# Altium project BeagleBone-AI.PrjPcb (part 2 of 5)

## Sheet 08 DDR VTT_LEDs.SchDoc
size 420 x 297 mm
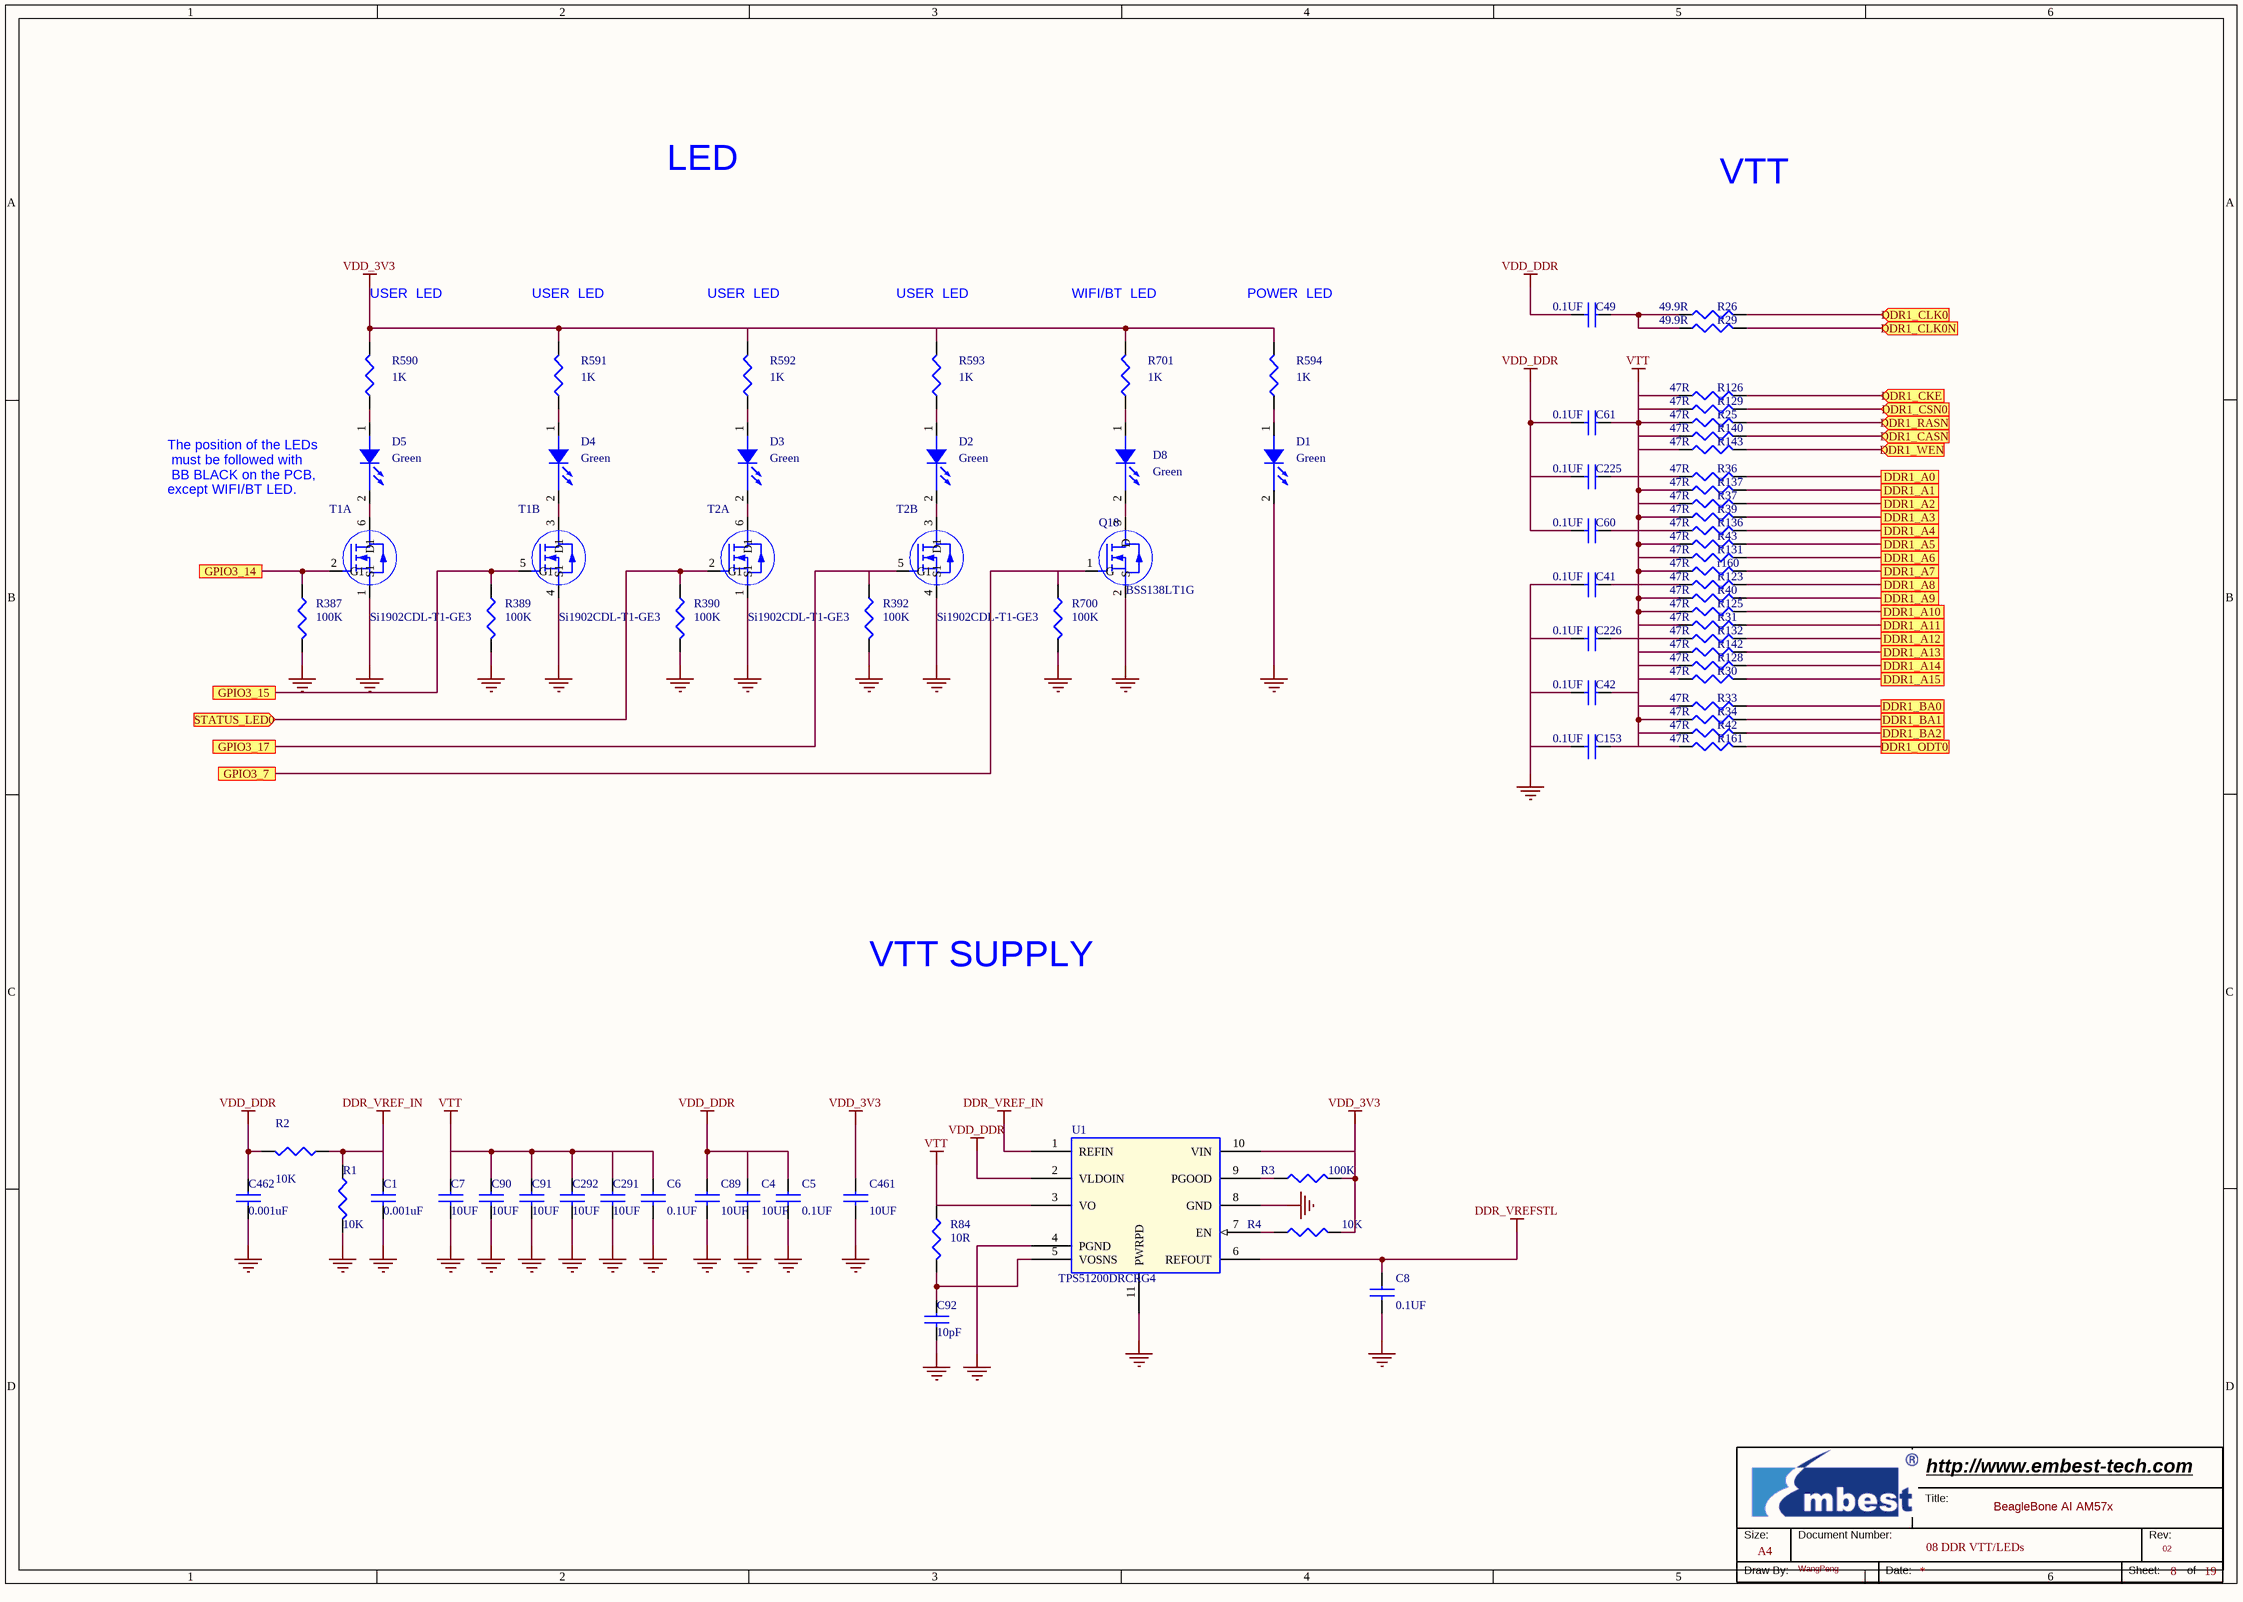
[diagram p6: 08 DDR VTT_LEDs.SchDoc]

### Parts
(Parts that share a designator on the sheet are numbered #1, #2 ... from top to bottom, then left to right.)
*#6  Page Count: 19  Page Number: 8  Page Size: A4  Title: BeagleBone AI AM57x  RevCode: 02  Doc: 08 DDR VTT/LEDs  Drawing: WangPeng  (hidden comment: Embest Title)  (graphical)
C1  0.001uF  [C0402]
C4  10UF  [C0603]
C5  0.1UF  [C0402]
C6  0.1UF  [C0402]
C7  10UF  [C0603]
C8  0.1UF  [C0402]
C41  0.1UF  [C0402]
C42  0.1UF  [C0402]
C49  0.1UF  [C0402]
C60  0.1UF  [C0402]
C61  0.1UF  [C0402]
C89  10UF  [C0603]
C90  10UF  [C0603]
C91  10UF  [C0603]
C92  10pF  [C0402]
C153  0.1UF  [C0402]
C225  0.1UF  [C0402]
C226  0.1UF  [C0402]
C291  10UF  [C0603]
C292  10UF  [C0603]
C461  10UF  [C0603]
C462  0.001uF  [C0402]
D1  Green  [D0603]
D2  Green  [D0603]
D3  Green  [D0603]
D4  Green  [D0603]
D5  Green  [D0603]
D8  Green  [D0603]
Q18  BSS138LT1G  [SOT95P240X111-3N]
R1  10K  [R0402]
R2  10K  [R0402]
R3  100K  [R0402]
R4  10K  [R0402]
R25  47R  [R0402]
R26  49.9R  [R0402]
R29  49.9R  [R0402]
R30  47R  [R0402]
R31  47R  [R0402]
R33  47R  [R0402]
R34  47R  [R0402]
R36  47R  [R0402]
R37  47R  [R0402]
R39  47R  [R0402]
R40  47R  [R0402]
R42  47R  [R0402]
R43  47R  [R0402]
R84  10R  [R0402]
R123  47R  [R0402]
R125  47R  [R0402]
R126  47R  [R0402]
R128  47R  [R0402]
R129  47R  [R0402]
R131  47R  [R0402]
R132  47R  [R0402]
R136  47R  [R0402]
R137  47R  [R0402]
R140  47R  [R0402]
R142  47R  [R0402]
R143  47R  [R0402]
r160  47R  [R0402]
R161  47R  [R0402]
R387  100K  [R0402]
R389  100K  [R0402]
R390  100K  [R0402]
R392  100K  [R0402]
R590  1K  [R0402]
R591  1K  [R0402]
R592  1K  [R0402]
R593  1K  [R0402]
R594  1K  [R0402]
R700  100K  [R0402]
R701  1K  [R0402]
T1  Si1902CDL-T1-GE3  [sot363_6]  (parts A,B of 2)
T2  Si1902CDL-T1-GE3  [sot363_6]  (parts A,B of 2)
U1  TPS51200DRCRG4  [VSON50P300X300X100-11N]

### Ports
DDR1_A0, DDR1_A1, DDR1_A2, DDR1_A3, DDR1_A4, DDR1_A5, DDR1_A6, DDR1_A7, DDR1_A8, DDR1_A9, DDR1_A10, DDR1_A11, DDR1_A12, DDR1_A13, DDR1_A14, DDR1_A15, DDR1_BA0, DDR1_BA1, DDR1_BA2, DDR1_CASN (in), DDR1_CKE (in), DDR1_CLK0 (in), DDR1_CLK0N (in), DDR1_CSN0 (in), DDR1_ODT0, DDR1_RASN (in), DDR1_WEN (in), GPIO3_7, GPIO3_14, GPIO3_15, GPIO3_17, STATUS_LED0 (in)

### Nets
DDR_VREF_IN: C1.1 R1.1 R2.1 U1.1(REFIN)
DDR_VREFSTL: C8.1 U1.6(REFOUT)
GND: C1.2 C4.2 C5.2 C6.2 C7.2 C8.2 C41.2 C42.2 C89.2 C90.2 C91.2 C92.2 C153.2 C226.2 C291.2 C292.2 C461.2 C462.2 D1.2(C) Q18.2(S) R1.2 R387.2 R389.2 R390.2 R392.2 R700.2 T1.1(S1) T1.4(S1) T2.1(S1) T2.4(S1) U1.4(PGND) U1.8(GND) U1.11(PWRPD)  [project net DDR1_RST]
VDD_3V3: C461.1 R3.2 R4.2 R590.2 R591.2 R592.2 R593.2 R594.2 R701.2 U1.10(VIN)
VDD_DDR: C4.1 C5.1 C49.2 C60.2 C61.2 C89.1 C225.2 C462.1 R2.2 U1.2(VLDOIN)
VTT: C6.1 C7.1 C42.1 C61.1 C90.1 C91.1 C153.1 C226.1 C291.1 C292.1 R25.2 R30.2 R31.2 R33.2 R34.2 R37.2 R39.2 R40.2 R42.2 R43.2 R84.1 R125.2 R126.2 R128.2 R129.2 R131.2 R132.2 R137.2 R140.2 R142.2 R143.2 r160.2 R161.2 U1.3(VO)
DDR1_A0: R36.1 ; port DDR1_A0
DDR1_A1: R137.1 ; port DDR1_A1
DDR1_A2: R37.1 ; port DDR1_A2
DDR1_A3: R39.1 ; port DDR1_A3
DDR1_A4: R136.1 ; port DDR1_A4
DDR1_A5: R43.1 ; port DDR1_A5
DDR1_A6: R131.1 ; port DDR1_A6
DDR1_A7: r160.1 ; port DDR1_A7
DDR1_A8: R123.1 ; port DDR1_A8
DDR1_A9: R40.1 ; port DDR1_A9
DDR1_A10: R125.1 ; port DDR1_A10
DDR1_A11: R31.1 ; port DDR1_A11
DDR1_A12: R132.1 ; port DDR1_A12
DDR1_A13: R142.1 ; port DDR1_A13
DDR1_A14: R128.1 ; port DDR1_A14
DDR1_A15: R30.1 ; port DDR1_A15
DDR1_BA0: R33.1 ; port DDR1_BA0
DDR1_BA1: R34.1 ; port DDR1_BA1
DDR1_BA2: R42.1 ; port DDR1_BA2
DDR1_CASN: R140.1 ; port DDR1_CASN
DDR1_CKE: R126.1 ; port DDR1_CKE
DDR1_CLK0: R26.1 ; port DDR1_CLK0
DDR1_CLK0N: R29.1 ; port DDR1_CLK0N
DDR1_CSN0: R129.1 ; port DDR1_CSN0
DDR1_ODT0: R161.1 ; port DDR1_ODT0
DDR1_RASN: R25.1 ; port DDR1_RASN
DDR1_WEN: R143.1 ; port DDR1_WEN
NetC41_1: C41.1 R123.2
NetC49_1: C49.1 R26.2 R29.2
NetC60_1: C60.1 R136.2
NetC92_1: C92.1 R84.2 U1.5(VOSNS)
NetC225_1: C225.1 R36.2
NetD1_1: D1.1(A) R594.1
NetD2_1: D2.1(A) R593.1
NetD2_2: D2.2(C) T2.3(D1)
NetD3_1: D3.1(A) R592.1
NetD3_2: D3.2(C) T2.6(D1)
NetD4_1: D4.1(A) R591.1
NetD4_2: D4.2(C) T1.3(D1)
NetD5_1: D5.1(A) R590.1
NetD5_2: D5.2(C) T1.6(D1)
NetD8_1: D8.1(A) R701.1
NetD8_2: D8.2(C) Q18.3(D)
NetQ18_1: Q18.1(G) R700.1 ; port GPIO3_7
NetR3_1: R3.1 U1.9(PGOOD)
NetR4_1: R4.1 U1.7(EN)
NetR387_1: R387.1 T1.2(G1) ; port GPIO3_14
NetR389_1: R389.1 T1.5(G1) ; port GPIO3_15
NetR390_1: R390.1 T2.2(G1) ; port STATUS_LED0
NetR392_1: R392.1 T2.5(G1) ; port GPIO3_17

### Notes on the sheet
- LED
- VTT
- (near R590) USER  LED
- (near R591) USER  LED
- (near R592) USER  LED
- (near R593) USER  LED
- (near R701) WIFI/BT  LED
- (near R594) POWER  LED
- The position of the LEDs
  must be followed with
  BB BLACK on the PCB,
  except WIFI/BT LED.
- VTT SUPPLY
- (in symbol Embest Title) Title:; Size:; Document Number:; Rev:; Draw By:; Date:; Sheet:; of

### Library data of the parts
C1 = C: CAP,1NF,+/-10%,X7R,50V,SMD0402; Manufacturer Part Number: GRM155R71H102KA01D; Manufacturer: Murata; Embest PN: 1004001100030; Part Type: Ceramic Capacitor
C4 C7 C89-C91 C291 C461 = C: as C113 on sheet 03 PMIC1; Part Type: Ceramic Capacitor; Datasheet: Y:\ÐÂK3ÏµÍ³ÎïÁÏdatasheet\[1003_1004]capacitor-resistor µçÈÝ¡¢µç×è\1004001100129T2 C1608X5R1A106M.pdf
C5 C41 C60 C61 C225 C226 = C: as C147 on sheet 03 PMIC1; Part Type: Ceramic Capacitor; Datasheet: Y:\ÐÂK3ÏµÍ³ÎïÁÏdatasheet\[1003_1004]capacitor-resistor µçÈÝ¡¢µç×è\1004001100047-GRM155R71C104KA88D.pdf
C6 C8 C42 C49 C153 = C: as C320 on sheet 03 PMIC1; Datasheet: Y:\ÐÂK3ÏµÍ³ÎïÁÏdatasheet\[1003_1004]capacitor-resistor µçÈÝ¡¢µç×è\1004001100047-GRM155R71C104KA88D.pdf; Part Type: Ceramic Capacitor
C92 = C: CAP,10PF,+/-5%,C0G,50V,SMD0402; Manufacturer: MURATA; Manufacturer Part Number: GRM1555C1H100JA01D; Embest PN: 1004001100005; Part Type: Ceramic Capacitor
C292 = C: as C130 on sheet 03 PMIC1; Datasheet: Y:\ÐÂK3ÏµÍ³ÎïÁÏdatasheet\[1003_1004]capacitor-resistor µçÈÝ¡¢µç×è\1004001100129T2 C1608X5R1A106M.pdf; Part Type: Ceramic Capacitor
C462 = C: CAP,1NF,+/-10%,X7R,50V,SMD0402; Manufacturer: Murata; Manufacturer Part Number: GRM155R71H102KA01D; Embest PN: 1004001100030; Part Type: Ceramic Capacitor
D1-D5 = LED: LED,Super Yellow Green,Water Clear,20mA,SMD0603; Manufacturer: Everlight; Manufacturer Part Number: 19-217/G7C-AN1P2/3T; Embest PN: 1006001100015; Part Type: LED; Status: AVL
D8 = LED: LED,Super Yellow Green,Water Clear,20mA,SMD0603; Manufacturer Part Number: 19-217/G7C-AN1P2/3T; Manufacturer: Everlight; Embest PN: 1006001100015; Status: AVL; Part Type: LED
Q18 = NMOS: Mosfet,N-Channel,BSS138LT1G,50V,0.2A,SOT-23,SMD; Manufacturer: ON; Embest PN: 1006015100009; Part Type: MOSFET; Manufacturer Part Number: BSS138LT1G; Status: AM5728; Datasheet: Y:\ÐÂK3ÏµÍ³ÎïÁÏdatasheet\[1006014~16]mosfet ³¡Ð§Ó¦¹Ü\1006015100009_bss138lt1g_ON.pdf
R1 = R: RES,10K,+/-1%,1/16W,SMD0402; Manufacturer Part Number: RC0402FR-0710KL; Manufacturer: YAGEO; Embest PN: 1003001100071; Part Type: Thick film Resistor
R2 = R: RES,10K,+/-1%,1/16W,SMD0402; Manufacturer: YAGEO; Manufacturer Part Number: RC0402FR-0710KL; Embest PN: 1003001100071; Part Type: Thick film Resistor
R3 R387 R389 R390 R392 R700 = R: RES,100K,+/-5%,1/16W,SMD0402; Manufacturer: YAGEO; Manufacturer Part Number: RC0402JR-07100KL; Embest PN: 1003001100119; Part Type: Thick film Resistor
R4 = R: as R121 on sheet 03 PMIC1; Part Type: Thick film Resistor
R25 R30 R33 R34 R36 R37 R40 R42 R43 R125 R126 R128 R132 R136 R143 r160 R161 = R: RES,47R,+/-1%,1/16W,SMD0402; Manufacturer: YAGEO; Manufacturer Part Number: RC0402FR-0747RL; Embest PN: 1003001100518; Part Type: Thick film Resistor
R26 = R: RES,49R9,+/-1%,1/16W,SMD0402; Manufacturer Part Number: RC0402FR-0749R9L; Manufacturer: YAGEO; Embest PN: 1003001100015; Part Type: Thick film Resistor
R29 = R: RES,49R9,+/-1%,1/16W,SMD0402; Manufacturer: YAGEO; Manufacturer Part Number: RC0402FR-0749R9L; Embest PN: 1003001100015; Part Type: Thick film Resistor
R31 R39 R123 R129 R131 R137 R140 R142 = R: RES,47R,+/-1%,1/16W,SMD0402; Manufacturer Part Number: RC0402FR-0747RL; Manufacturer: YAGEO; Embest PN: 1003001100518; Part Type: Thick film Resistor
R84 = R: RES,10R,+/-1%,1/16W,SMD0402; Manufacturer Part Number: RC0402FR-0710RL; Manufacturer: YAGEO; Embest PN: 1003001100004; Part Type: Thick film Resistor
R590 R592 R594 = R: RES,1K,+/-5%,1/16W,SMD0402; Manufacturer: YAGEO; Manufacturer Part Number: RC0402JR-071KL; Embest PN: 1003001100035; Part Type: Thick film Resistor
R591 R593 R701 = R: RES,1K,+/-5%,1/16W,SMD0402; Manufacturer Part Number: RC0402JR-071KL; Manufacturer: YAGEO; Embest PN: 1003001100035; Part Type: Thick film Resistor
T1 T2 = NMOS_2S2G2D: Mosfet,N-Channel,Si1902CDL-T1-GE3,20V,385mohm,1.5A,SOT-363,SMD; Manufacturer: VISHAY; Embest PN: 1006015100011; Part Type: MOSFET; Manufacturer Part Number: Si1902CDL-T1-GE3; Status: TBD; Datasheet: Y:\ÐÂK3ÏµÍ³ÎïÁÏdatasheet\[1006014~16]mosfet ³¡Ð§Ó¦¹Ü\1006015100011_si1902cdl_Vishay.pdf
U1 = TPS51200: IC Sink and Source DDR Termination Regulator VSON-10 SMD; Manufacturer: TI; Embest PN: 1002020100280; Part Type: Specific IC; Manufacturer Part Number: TPS51200DRCRG4; Status: AM5728; Datasheet: Y:\ÐÂK3ÏµÍ³ÎïÁÏdatasheet\[1002]IC ¼¯³ÉµçÂ·\1002020100280 [TPS51200DRCRG4]TPS51200.pdf
*#6 = Embest Title: Page Create Date: May 29, 2006; WebSite: http://www.embest-tech.com; Company: Embest; Page Modify Date: *

## Sheet 09 MMC_UBOOT.SchDoc
size 420 x 297 mm
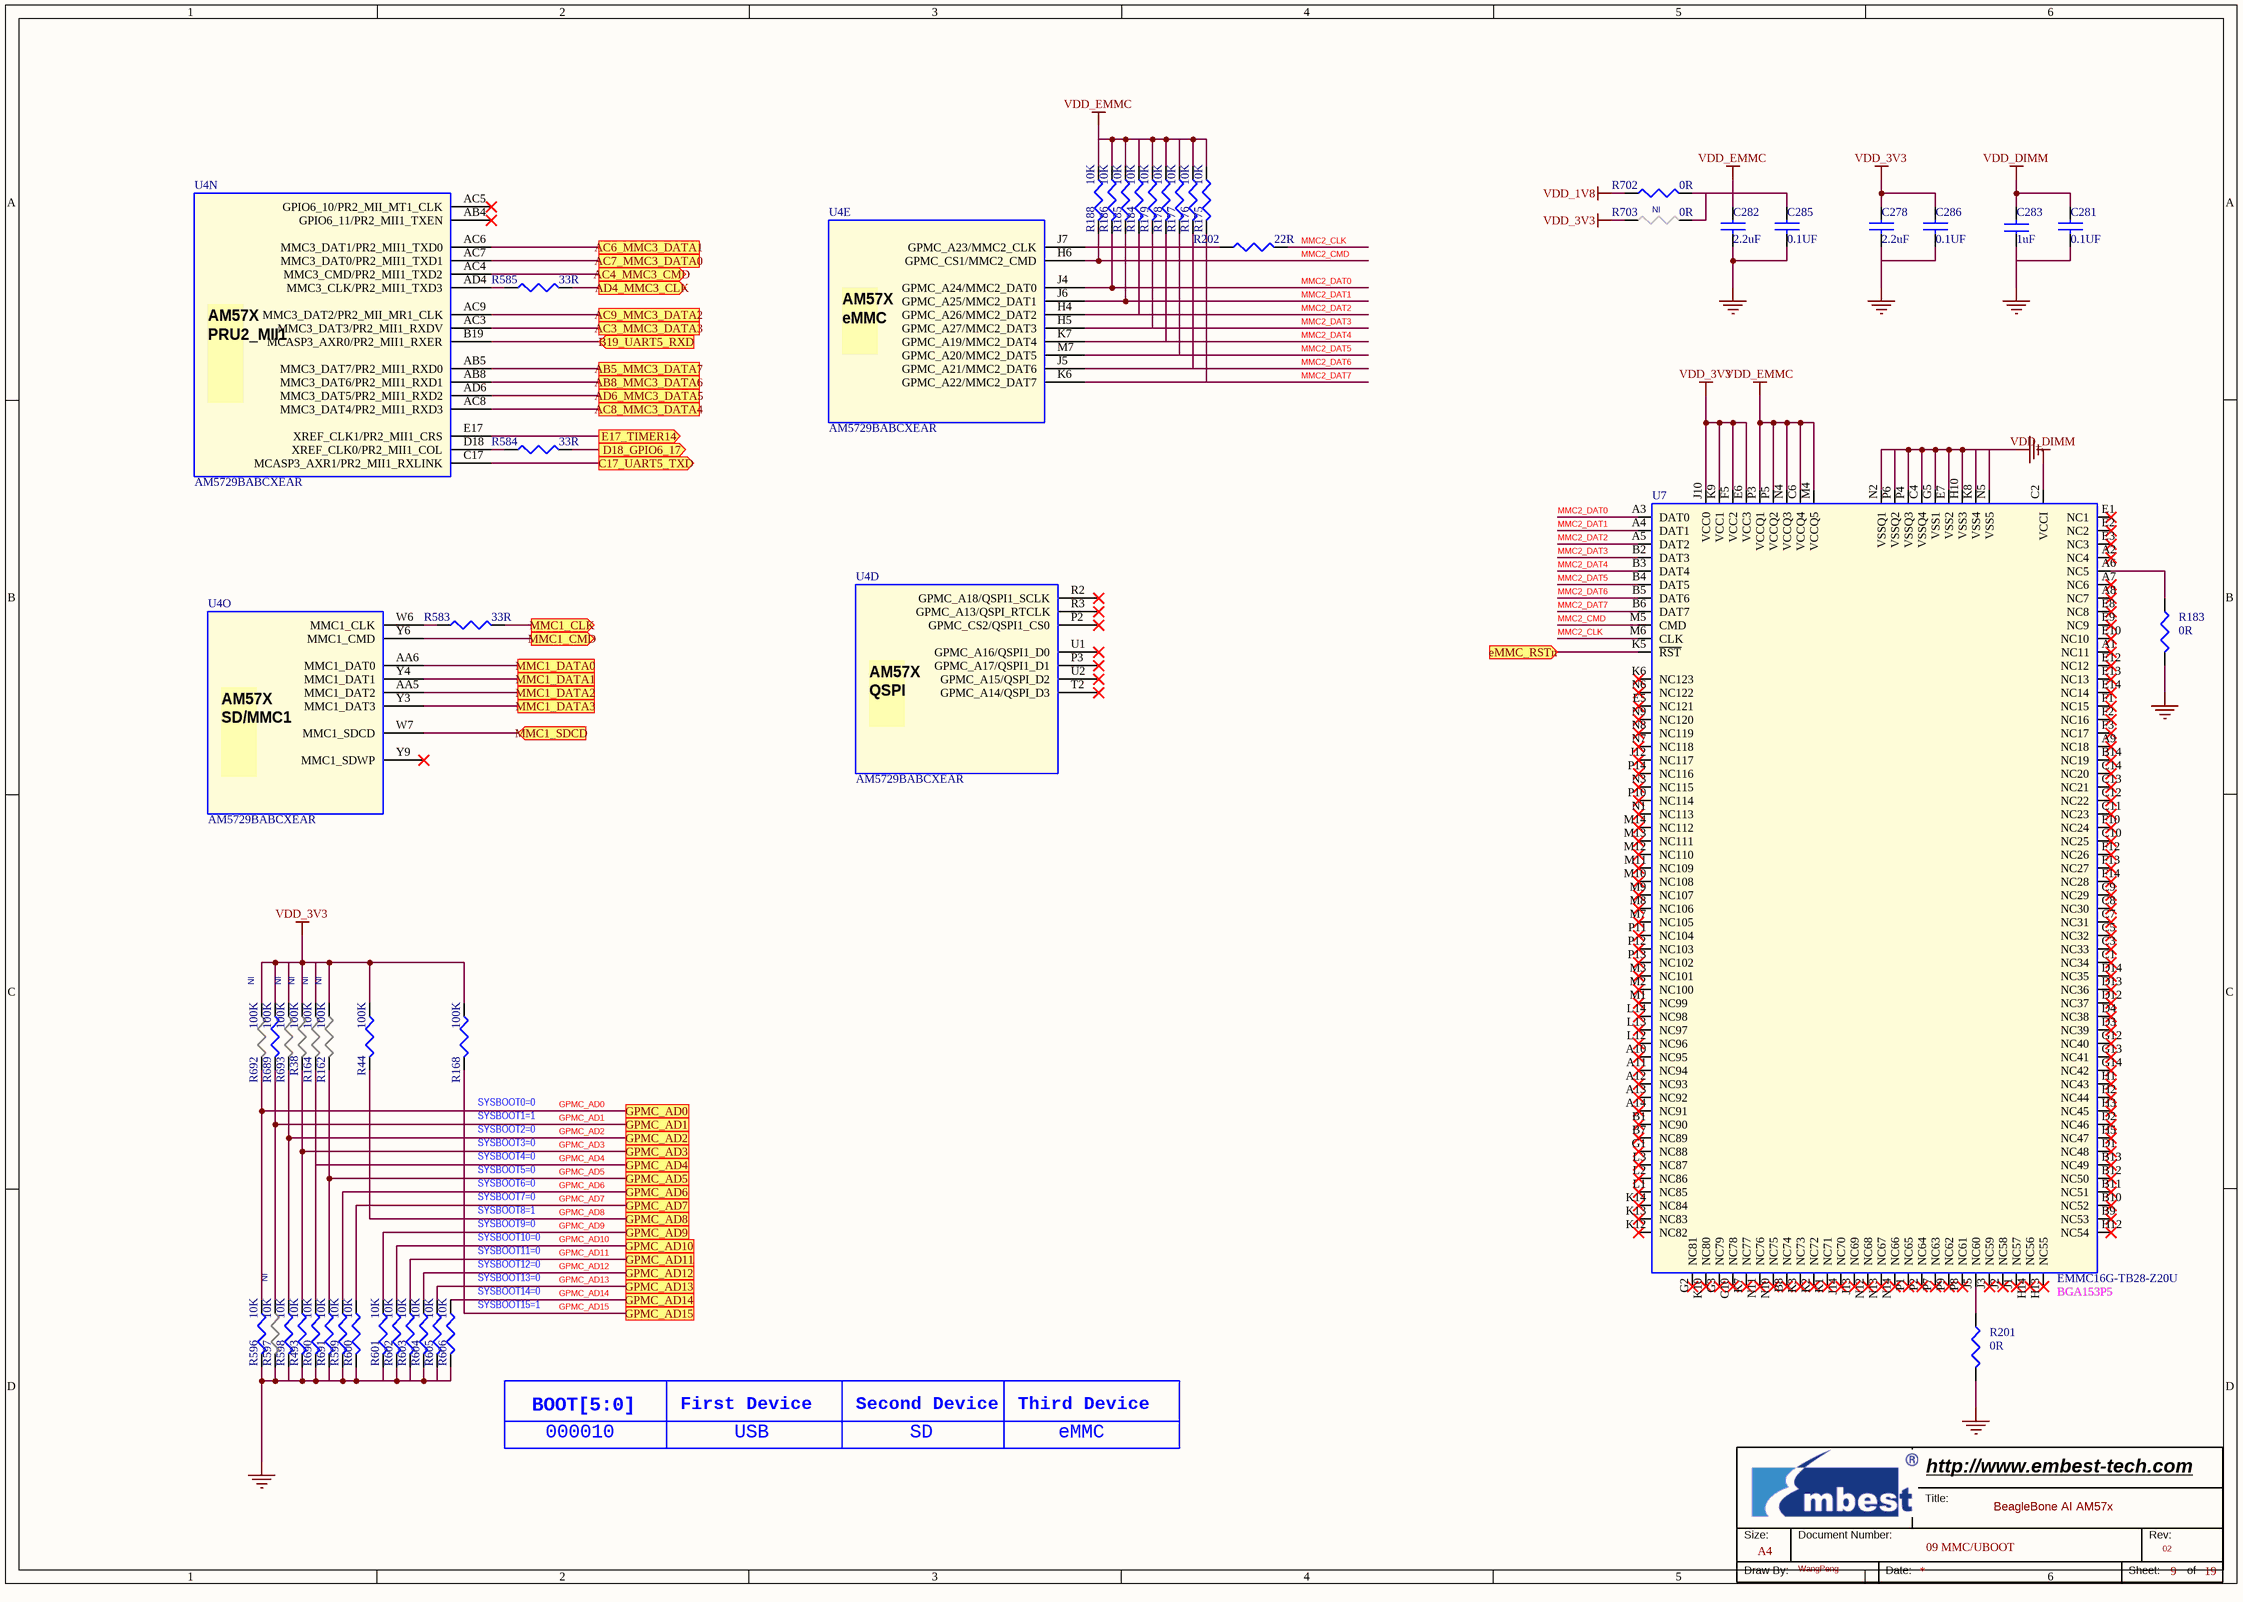
[diagram p7: 09 MMC_UBOOT.SchDoc]

### Parts
(Parts that share a designator on the sheet are numbered #1, #2 ... from top to bottom, then left to right.)
*#7  Page Count: 19  Page Number: 9  Page Size: A4  Title: BeagleBone AI AM57x  RevCode: 02  Doc: 09 MMC/UBOOT  Drawing: WangPeng  (hidden comment: Embest Title)  (graphical)
C278  2.2uF  [C0603]
C281  0.1UF  [C0402]
C282  2.2uF  [C0603]
C283  1uF  [C0402]
C285  0.1UF  [C0402]
C286  0.1UF  [C0402]
R38  100K  ASSY: NI  [R0402]
R44  100K  [R0402]
R162  100K  ASSY: NI  [R0402]
R164  100K  ASSY: NI  [R0402]
R168  100K  [R0402]
R175  10K  [R0402]
R176  10K  [R0402]
R177  10K  [R0402]
R178  10K  [R0402]
R179  10K  [R0402]
R183  0R  [R0402]
R184  10K  [R0402]
R185  10K  [R0402]
R186  10K  [R0402]
R188  10K  [R0402]
R201  0R  [R0402]
R202  22R  [R0402]
R493  10K  [R0402]
R583  33R  [R0402]
R584  33R  [R0402]
R585  33R  [R0402]
R596  10K  [R0402]
R597  10K  ASSY: NI  [R0402]
R598  10K  [R0402]
R599  10K  [R0402]
R600  10K  [R0402]
R601  10K  [R0402]
R602  10K  [R0402]
R603  10K  [R0402]
R604  10K  [R0402]
R605  10K  [R0402]
R606  10K  [R0402]
R689  100K  [R0402]
R690  10K  [R0402]
R691  10K  [R0402]
R692  100K  ASSY: NI  [R0402]
R693  100K  ASSY: NI  [R0402]
R702  0R  [R0402]
R703  0R  ASSY: NI  [R0402]
U4  AM5729BABCXEAR  [BGA23X23-760-117M]  (parts D,E,N,O of 29)
U7  EMMC16G-TB28-Z20U  [BGA153P5]

### Ports
AB5_MMC3_DATA7, AB8_MMC3_DATA6, AC3_MMC3_DATA3, AC4_MMC3_CMD (out), AC6_MMC3_DATA1, AC7_MMC3_DATA0, AC8_MMC3_DATA4, AC9_MMC3_DATA2, AD4_MMC3_CLK (out), AD6_MMC3_DATA5, B19_UART5_RXD (in), C17_UART5_TXD (out), D18_GPIO6_17 (out), E17_TIMER14 (out), eMMC_RSTn (in), GPMC_AD0, GPMC_AD1, GPMC_AD2, GPMC_AD3, GPMC_AD4, GPMC_AD5, GPMC_AD6, GPMC_AD7, GPMC_AD8, GPMC_AD9, GPMC_AD10, GPMC_AD11, GPMC_AD12, GPMC_AD13, GPMC_AD14, GPMC_AD15, MMC1_CLK (out), MMC1_CMD (out), MMC1_DATA0, MMC1_DATA1, MMC1_DATA2, MMC1_DATA3, MMC1_SDCD (in)

### Nets
GND: C278.2 C281.2 C282.2 C283.1 C285.2 C286.2 R183.2 R201.2 R493.2 R596.2 R597.2 R598.2 R599.2 R600.2 R601.2 R602.2 R603.2 R604.2 R605.2 R606.2 R690.2 R691.2 U7.C4(VSSQ4) U7.E7(VSS2) U7.G5(VSS1) U7.H10(VSS3) U7.K8(VSS4) U7.N2(VSSQ1) U7.N5(VSS5) U7.P4(VSSQ3) U7.P6(VSSQ2)  [project net DDR1_RST]
VDD_1V8: R702.1
VDD_3V3: C278.1 C286.1 R38.1 R44.1 R162.1 R164.1 R168.1 R689.1 R692.1 R693.1 R703.1 U7.E6(VCC3) U7.F5(VCC2) U7.J10(VCC0) U7.K9(VCC1)
VDD_DIMM: C281.1 C283.2 U7.C2(VCCI)
VDD_EMMC: C282.1 R175.1 R176.1 R177.1 R178.1 R179.1 R184.1 R185.1 R186.1 R188.1 U7.C6(VCCQ4) U7.M4(VCCQ5) U7.N4(VCCQ3) U7.P3(VCCQ1) U7.P5(VCCQ2)
GPMC_AD0: R596.1 R692.2 ; port GPMC_AD0
GPMC_AD1: R597.1 R689.2 ; port GPMC_AD1
GPMC_AD2: R598.1 R693.2 ; port GPMC_AD2
GPMC_AD3: R38.2 R493.1 ; port GPMC_AD3
GPMC_AD4: R164.2 R690.1 ; port GPMC_AD4
GPMC_AD5: R162.2 R691.1 ; port GPMC_AD5
GPMC_AD6: R599.1 ; port GPMC_AD6
GPMC_AD7: R600.1 ; port GPMC_AD7
GPMC_AD8: R44.2 ; port GPMC_AD8
GPMC_AD9: R601.1 ; port GPMC_AD9
GPMC_AD10: R602.1 ; port GPMC_AD10
GPMC_AD11: R603.1 ; port GPMC_AD11
GPMC_AD12: R604.1 ; port GPMC_AD12
GPMC_AD13: R605.1 ; port GPMC_AD13
GPMC_AD14: R606.1 ; port GPMC_AD14
GPMC_AD15: R168.2 ; port GPMC_AD15
MMC2_CLK: R202.2 U7.M6(CLK)
MMC2_CMD: R188.2 U4.H6(GPMC_CS1/MMC2_CMD) U7.M5(CMD)
MMC2_DAT0: R186.2 U4.J4(GPMC_A24/MMC2_DAT0) U7.A3(DAT0)
MMC2_DAT1: R185.2 U4.J6(GPMC_A25/MMC2_DAT1) U7.A4(DAT1)
MMC2_DAT2: R184.2 U4.H4(GPMC_A26/MMC2_DAT2) U7.A5(DAT2)
MMC2_DAT3: R179.2 U4.H5(GPMC_A27/MMC2_DAT3) U7.B2(DAT3)
MMC2_DAT4: R178.2 U4.K7(GPMC_A19/MMC2_DAT4) U7.B3(DAT4)
MMC2_DAT5: R177.2 U4.M7(GPMC_A20/MMC2_DAT5) U7.B4(DAT5)
MMC2_DAT6: R176.2 U4.J5(GPMC_A21/MMC2_DAT6) U7.B5(DAT6)
MMC2_DAT7: R175.2 U4.K6(GPMC_A22/MMC2_DAT7) U7.B6(DAT7)
NetC285_1: C285.1 R702.2 R703.2
NetC473_1: R583.2 ; port MMC1_CLK
NetJ90_1: U4.AA5(MMC1_DAT2) ; port MMC1_DATA2
NetJ90_2: U4.Y3(MMC1_DAT3) ; port MMC1_DATA3
NetJ90_3: U4.Y6(MMC1_CMD) ; port MMC1_CMD
NetJ90_7: U4.AA6(MMC1_DAT0) ; port MMC1_DATA0
NetJ90_8: U4.Y4(MMC1_DAT1) ; port MMC1_DATA1
NetJ90_9: U4.W7(MMC1_SDCD) ; port MMC1_SDCD
Netp8_3: U4.AB8(MMC3_DAT6/PR2_MII1_RXD1) ; port AB8_MMC3_DATA6
Netp8_4: U4.AB5(MMC3_DAT7/PR2_MII1_RXD0) ; port AB5_MMC3_DATA7
Netp8_5: U4.AC9(MMC3_DAT2/PR2_MII_MR1_CLK) ; port AC9_MMC3_DATA2
Netp8_6: U4.AC3(MMC3_DAT3/PR2_MII1_RXDV) ; port AC3_MMC3_DATA3
Netp8_9: U4.E17(XREF_CLK1/PR2_MII1_CRS) ; port E17_TIMER14
Netp8_20: U4.AC4(MMC3_CMD/PR2_MII1_TXD2) ; port AC4_MMC3_CMD
Netp8_21: R585.2 ; port AD4_MMC3_CLK
Netp8_22: U4.AD6(MMC3_DAT5/PR2_MII1_RXD2) ; port AD6_MMC3_DATA5
Netp8_23: U4.AC8(MMC3_DAT4/PR2_MII1_RXD3) ; port AC8_MMC3_DATA4
Netp8_24: U4.AC6(MMC3_DAT1/PR2_MII1_TXD0) ; port AC6_MMC3_DATA1
Netp8_25: U4.AC7(MMC3_DAT0/PR2_MII1_TXD1) ; port AC7_MMC3_DATA0
Netp9_13: U4.C17(MCASP3_AXR1/PR2_MII1_RXLINK) ; port C17_UART5_TXD
Netp9_25: R584.2 ; port D18_GPIO6_17
NetR56_1: U7.K5(~{RST}) ; port eMMC_RSTn
NetR183_1: R183.1 U7.A6(NC5)
NetR201_1: R201.1 U7.J5(NC60)
NetR202_1: R202.1 U4.J7(GPMC_A23/MMC2_CLK)
NetR583_1: R583.1 U4.W6(MMC1_CLK)
NetR584_1: R584.1 U4.D18(XREF_CLK0/PR2_MII1_COL)
NetR585_1: R585.1 U4.AD4(MMC3_CLK/PR2_MII1_TXD3)
NetR687_1: U4.B19(MCASP3_AXR0/PR2_MII1_RXER) ; port B19_UART5_RXD

Not connected (* = marked no-connect by the designer): U4 AB4(GPIO6_11/PR2_MII1_TXEN)* AC5(GPIO6_10/PR2_MII_MT1_CLK)* P2(GPMC_CS2/QSPI1_CS0)* P3(GPMC_A17/QSPI1_D1)* R2(GPMC_A18/QSPI1_SCLK)* R3(GPMC_A13/QSPI_RTCLK)* T2(GPMC_A14/QSPI_D3)* U1(GPMC_A16/QSPI1_D0)* U2(GPMC_A15/QSPI_D2)* Y9(MMC1_SDWP)*; U7 A1(NC11)* A2(NC4)* A7(NC6)* A8(NC7)* A9(NC18)* A10(NC95)* A11(NC94)* A12(NC93)* A13(NC92)* A14(NC91)* B1(NC90)* B7(NC89)* B8(NC74)* B9(NC53)* B10(NC52)* B11(NC51)* B12(NC50)* B13(NC49)* B14(NC19)* C1(NC34)* C3(NC33)* C5(NC32)* C7(NC31)* C8(NC30)* C9(NC29)* C10(NC25)* C11(NC23)* C12(NC22)* C13(NC21)* C14(NC20)* D1(NC48)* D2(NC46)* D3(NC39)* D4(NC38)* D12(NC37)* D13(NC36)* D14(NC35)* E1(NC1)* E2(NC2)* E3(NC3)* E5(NC121)* E8(NC8)* E9(NC9)* E10(NC10)* E12(NC12)* E13(NC13)* E14(NC14)* F1(NC15)* F2(NC16)* F3(NC17)* F10(NC24)* F12(NC26)* F13(NC27)* F14(NC28)* G1(NC88)* G2(NC81)* G3(NC79)* G10(NC78)* G12(NC40)* G13(NC41)* G14(NC42)* H1(NC43)* H2(NC44)* H3(NC45)* H5(NC47)* H12(NC54)* H13(NC55)* H14(NC56)* J1(NC57)* J2(NC58)* J3(NC59)* J12(NC117)* J13(NC69)* J14(NC70)* K1(NC71)* K2(NC72)* K3(NC73)* K6(NC123)* K7(NC77)* K10(NC80)* K12(NC82)* K13(NC83)* K14(NC84)* L1(NC85)* L2(NC86)* L3(NC87)* L12(NC96)* L13(NC97)* L14(NC98)* M1(NC99)* M2(NC100)* M3(NC101)* M7(NC105)* M8(NC106)* M9(NC107)* M10(NC108)* M11(NC109)* M12(NC110)* M13(NC111)* M14(NC112)* N1(NC113)* N3(NC115)* N6(NC122)* N7(NC118)* N8(NC119)* N9(NC120)* N10(NC75)* N11(NC76)* N12(NC68)* N13(NC67)* N14(NC66)* P1(NC65)* P2(NC64)* P7(NC63)* P8(NC61)* P9(NC62)* P10(NC114)* P11(NC104)* P12(NC103)* P13(NC102)* P14(NC116)*

### Notes on the sheet
- (near R168) SYSBOOT0=0
- SYSBOOT1=1
- SYSBOOT2=0
- SYSBOOT3=0
- SYSBOOT4=0
- SYSBOOT5=0
- SYSBOOT6=0
- SYSBOOT7=0
- SYSBOOT8=1
- SYSBOOT9=0
- SYSBOOT10=0
- SYSBOOT11=0
- SYSBOOT12=0
- SYSBOOT13=0
- SYSBOOT14=0
- SYSBOOT15=1
- BOOT[5:0]
- 000010
- First Device
- USB
- Second Device
- SD
- Third Device
- eMMC
- (in symbol AM57X, part D) AM57X / QSPI /
- (in symbol AM57X, part E) AM57X / eMMC /
- (in symbol AM57X, part N) AM57X / PRU2_MII1 /
- (in symbol AM57X, part O) AM57X / SD/MMC1 /
- (in symbol Embest Title) Title:; Size:; Document Number:; Rev:; Draw By:; Date:; Sheet:; of

### Library data of the parts
C278 = C: CAP,2.2UF,+/-10%,X5R,16V,SMD0603; Manufacturer: Murata; Manufacturer Part Number: GRM188R61C225KE15D; Embest PN: 1004001100124; Part Type: Ceramic Capacitor
C281 C286 = C: CAP,100NF,+/-10%,X7R,16V,SMD0402; Manufacturer Part Number: GRM155R71C104KA88D; Manufacturer: Murata; Embest PN: 1004001100047; Datasheet: Y:\ÐÂK3ÏµÍ³ÎïÁÏdatasheet\[1003_1004]capacitor-resistor µçÈÝ¡¢µç×è\1004001100047-GRM155R71C104KA88D.pdf; Part Type: Ceramic Capacitor
C282 = C: CAP,2.2UF,+/-10%,X5R,16V,SMD0603; Manufacturer Part Number: GRM188R61C225KE15D; Manufacturer: Murata; Embest PN: 1004001100124; Part Type: Ceramic Capacitor
C283 = C: CAP,1UF,+/-10%,X5R,10V,SMD0402; Manufacturer Part Number: GRM155R61A105KE15D; Manufacturer: Murata; Embest PN: 1004001100057; Part Type: Ceramic Capacitor
C285 = C: CAP,100NF,+/-10%,X7R,16V,SMD0402; Manufacturer: Murata; Manufacturer Part Number: GRM155R71C104KA88D; Embest PN: 1004001100047; Part Type: Ceramic Capacitor; Datasheet: Y:\ÐÂK3ÏµÍ³ÎïÁÏdatasheet\[1003_1004]capacitor-resistor µçÈÝ¡¢µç×è\1004001100047-GRM155R71C104KA88D.pdf
R38 R44 R162 R692 = R: RES,100K,+/-5%,1/16W,SMD0402; Manufacturer: YAGEO; Manufacturer Part Number: RC0402JR-07100KL; Embest PN: 1003001100119; Part Type: Thick film Resistor
R164 R168 R689 R693 = R: RES,100K,+/-5%,1/16W,SMD0402; Manufacturer Part Number: RC0402JR-07100KL; Manufacturer: YAGEO; Embest PN: 1003001100119; Part Type: Thick film Resistor
R175 R177 R179 R185 R493 R599 R601 R603 R605 R691 = R: RES,10K,+/-5%,1/16W,SMD0402; Manufacturer Part Number: RC0402JR-0710KL; Manufacturer: YAGEO; Embest PN: 1003001100072; Part Type: Thick film Resistor
R176 R178 R184 R186 R188 R596-R598 R600 R602 R604 R606 R690 = R: RES,10K,+/-5%,1/16W,SMD0402; Manufacturer: YAGEO; Manufacturer Part Number: RC0402JR-0710KL; Embest PN: 1003001100072; Part Type: Thick film Resistor
R183 R201 R702 = R: RES,0R,+/-5%,1/16W,SMD0402; Manufacturer: YAGEO; Manufacturer Part Number: RC0402JR-070RL; Embest PN: 1003001100001; Part Type: Thick film Resistor
R202 = R: RES,22R,+/-5%,1/16W,SMD0402; Manufacturer: YAGEO; Manufacturer Part Number: RC0402JR-0722RL; Embest PN: 1003001100007; Part Type: Thick film Resistor
R583-R585 = R: RES,33R,+/-5%,1/16W,SMD0402; Manufacturer Part Number: RC0402JR-0733RL; Manufacturer: YAGEO; Embest PN: 1003001100010; Part Type: Thick film Resistor
R703 = R: RES,0R,+/-5%,1/16W,SMD0402; Manufacturer Part Number: RC0402JR-070RL; Manufacturer: YAGEO; Embest PN: 1003001100001; Part Type: Thick film Resistor
U4 = AM57X: IC ARM Dual Cortex-A15 Microprocessor FCBGA(ABC)-760 SMD JEDEC TRAY; Vendor: TI; Embest PN: 1002001100053; Part Type: MPU; Manufacturer: TI; Manufacturer Part Number: AM5729BABCXEAR; Status: BeagleBone AI
U7 = EMMC08G-W325-X01: IC,Memory,16GB,EMMC,EMMC16G-TB28-Z20U,FBGA153,SMD; Manufacturer: Kingston; Embest PN: 1002003100376; PCB Footprint: BGA153P5; Part Type: Memory; Manufacturer Part Number: EMMC16G-TB28-Z20U; Status: BeagleBone AI
*#7 = Embest Title: Page Create Date: May 29, 2006; WebSite: http://www.embest-tech.com; Company: Embest; Page Modify Date: *

## Sheet 10 AM572x Interface 1.SchDoc
size 420 x 297 mm
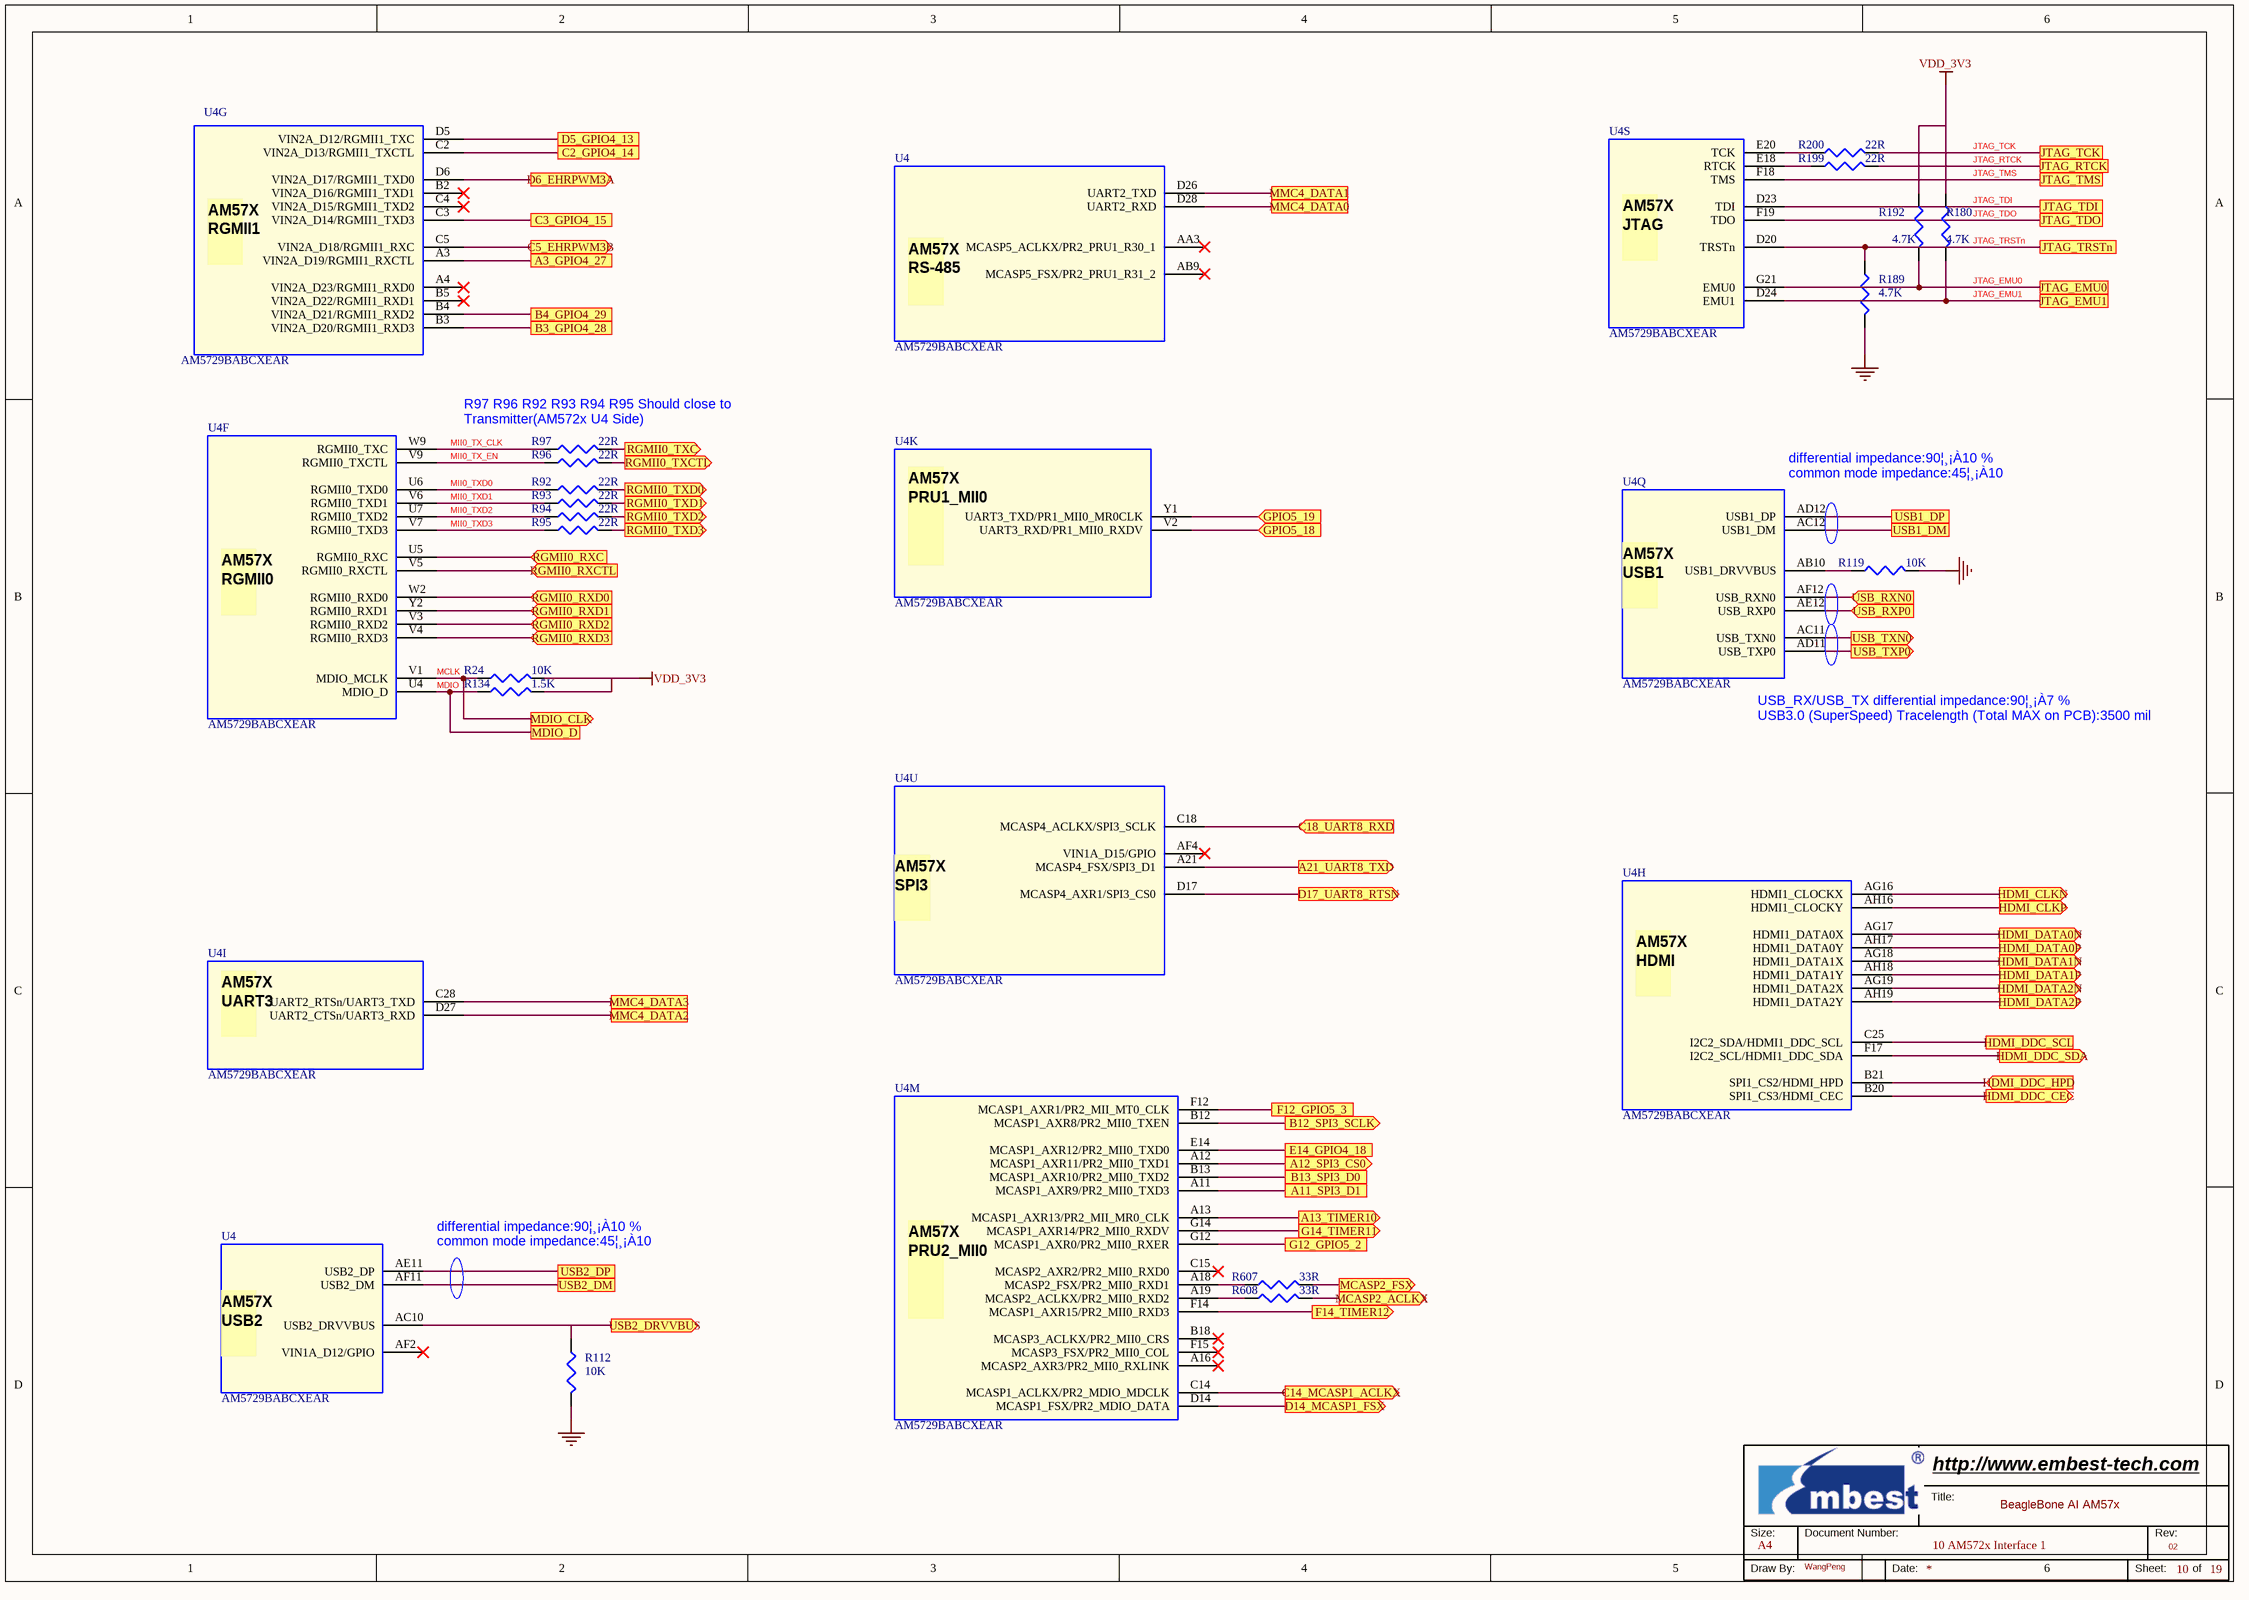
[diagram p8: 10 AM572x Interface 1.SchDoc]

### Parts
(Parts that share a designator on the sheet are numbered #1, #2 ... from top to bottom, then left to right.)
*#8  Page Count: 19  Page Number: 10  Page Size: A4  Title: BeagleBone AI AM57x  RevCode: 02  Doc: 10 AM572x Interface 1  Drawing: WangPeng  (hidden comment: Embest Title)  (graphical)
R24  10K  [R0402]
R92  22R  [R0402]
R93  22R  [R0402]
R94  22R  [R0402]
R95  22R  [R0402]
R96  22R  [R0402]
R97  22R  [R0402]
R112  10K  [R0402]
R119  10K  [R0402]
R134  1.5K  [R0402]
R180  4.7K  [R0402]
R189  4.7K  [R0402]
R192  4.7K  [R0402]
R199  22R  [R0402]
R200  22R  [R0402]
R607  33R  [R0402]
R608  33R  [R0402]
U4  AM5729BABCXEAR  [BGA23X23-760-117M]  (parts F,G,H,I,K,M,Q,S,U,27,29 of 29)

### Ports
A3_GPIO4_27, A11_SPI3_D1, A12_SPI3_CS0 (out), A13_TIMER10 (out), A21_UART8_TXD (out), B3_GPIO4_28, B4_GPIO4_29, B12_SPI3_SCLK (out), B13_SPI3_D0, C2_GPIO4_14, C3_GPIO4_15, C5_EHRPWM3B (out), C14_MCASP1_ACLKX (out), C18_UART8_RXD (in), D5_GPIO4_13, D6_EHRPWM3A (out), D14_MCASP1_FSX (out), D17_UART8_RTSN (out), E14_GPIO4_18, F12_GPIO5_3, F14_TIMER12 (out), G12_GPIO5_2, G14_TIMER11 (out), GPIO5_18 (in), GPIO5_19 (in), HDMI_CLKN (out), HDMI_CLKP (out), HDMI_DATA0N (out), HDMI_DATA0P (out), HDMI_DATA1N (out), HDMI_DATA1P (out), HDMI_DATA2N (out), HDMI_DATA2P (out), HDMI_DDC_CEC (out), HDMI_DDC_HPD (in), HDMI_DDC_SCL, HDMI_DDC_SDA (out), JTAG_EMU0, JTAG_EMU1, JTAG_RTCK, JTAG_TCK, JTAG_TDI, JTAG_TDO, JTAG_TMS, JTAG_TRSTn, MCASP2_ACLKX (out), MCASP2_FSX (out), MDIO_CLK (out), MDIO_D, MMC4_DATA0, MMC4_DATA1, MMC4_DATA2, MMC4_DATA3, RGMII0_RXC (in), RGMII0_RXCTL (in), RGMII0_RXD0 (in), RGMII0_RXD1 (in), RGMII0_RXD2 (in), RGMII0_RXD3 (in), RGMII0_TXC (out), RGMII0_TXCTL (out), RGMII0_TXD0 (out), RGMII0_TXD1 (out), RGMII0_TXD2 (out), RGMII0_TXD3 (out), USB1_DM, USB1_DP, USB2_DM, USB2_DP, USB2_DRVVBUS (out), USB_RXN0 (in), USB_RXP0 (in), USB_TXN0 (out), USB_TXP0 (out)

### Nets
GND: R112.2 R119.2 R189.2  [project net DDR1_RST]
VDD_3V3: R24.2 R134.2 R180.1 R192.1
JTAG_EMU0: R192.2 U4.G21(EMU0) ; port JTAG_EMU0
JTAG_EMU1: R180.2 U4.D24(EMU1) ; port JTAG_EMU1
JTAG_RTCK: R199.2 ; port JTAG_RTCK
JTAG_TCK: R200.2 ; port JTAG_TCK
JTAG_TDI: U4.D23(TDI) ; port JTAG_TDI
JTAG_TDO: U4.F19(TDO) ; port JTAG_TDO
JTAG_TMS: U4.F18(TMS) ; port JTAG_TMS
JTAG_TRSTn: R189.1 U4.D20(TRSTn) ; port JTAG_TRSTn
MCLK: R24.1 U4.V1(MDIO_MCLK) ; port MDIO_CLK
MDIO: R134.1 U4.U4(MDIO_D) ; port MDIO_D
MII0_INT: U4.Y1(UART3_TXD/PR1_MII0_MR0CLK) ; port GPIO5_19
MII0_TX_CLK: R97.1 U4.W9(RGMII0_TXC)
MII0_TX_EN: R96.1 U4.V9(RGMII0_TXCTL)
MII0_TXD0: R92.1 U4.U6(RGMII0_TXD0)
MII0_TXD1: R93.1 U4.V6(RGMII0_TXD1)
MII0_TXD2: R94.1 U4.U7(RGMII0_TXD2)
MII0_TXD3: R95.1 U4.V7(RGMII0_TXD3)
TypeC_D+: U4.AD12(USB1_DP) ; port USB1_DP
TypeC_D-: U4.AC12(USB1_DM) ; port USB1_DM
NetD79_2: U4.AF11(USB2_DM) ; port USB2_DM
NetD79_3: U4.AE11(USB2_DP) ; port USB2_DP
Netp8_7: U4.G14(MCASP1_AXR14/PR2_MII0_RXDV) ; port G14_TIMER11
Netp8_8: U4.F14(MCASP1_AXR15/PR2_MII0_RXD3) ; port F14_TIMER12
Netp8_10: U4.A13(MCASP1_AXR13/PR2_MII_MR0_CLK) ; port A13_TIMER10
Netp8_14: U4.D5(VIN2A_D12/RGMII1_TXC) ; port D5_GPIO4_13
Netp8_16: U4.B4(VIN2A_D21/RGMII1_RXD2) ; port B4_GPIO4_29
Netp8_26: U4.B3(VIN2A_D20/RGMII1_RXD3) ; port B3_GPIO4_28
Netp9_14: U4.D6(VIN2A_D17/RGMII1_TXD0) ; port D6_EHRPWM3A
Netp9_16: U4.C5(VIN2A_D18/RGMII1_RXC) ; port C5_EHRPWM3B
Netp9_28: U4.A12(MCASP1_AXR11/PR2_MII0_TXD1) ; port A12_SPI3_CS0
Netp9_30: U4.B13(MCASP1_AXR10/PR2_MII0_TXD2) ; port B13_SPI3_D0
NetR92_2: R92.2 ; port RGMII0_TXD0
NetR93_2: R93.2 ; port RGMII0_TXD1
NetR94_2: R94.2 ; port RGMII0_TXD2
NetR95_2: R95.2 ; port RGMII0_TXD3
NetR96_2: R96.2 ; port RGMII0_TXCTL
NetR97_2: R97.2 ; port RGMII0_TXC
NetR112_1: R112.1 U4.AC10(USB2_DRVVBUS) ; port USB2_DRVVBUS
NetR119_1: R119.1 U4.AB10(USB1_DRVVBUS)
NetR199_1: R199.1 U4.E18(RTCK)
NetR200_1: R200.1 U4.E20(TCK)
NetR333_1: U4.D27(UART2_CTSn/UART3_RXD) ; port MMC4_DATA2
NetR334_1: U4.C28(UART2_RTSn/UART3_TXD) ; port MMC4_DATA3
NetR336_1: U4.D28(UART2_RXD) ; port MMC4_DATA0
NetR337_1: U4.D26(UART2_TXD) ; port MMC4_DATA1
NetR409_2: U4.B20(SPI1_CS3/HDMI_CEC) ; port HDMI_DDC_CEC
NetR458_1: U4.W2(RGMII0_RXD0) ; port RGMII0_RXD0
NetR459_1: U4.Y2(RGMII0_RXD1) ; port RGMII0_RXD1
NetR460_1: U4.V3(RGMII0_RXD2) ; port RGMII0_RXD2
NetR462_1: U4.V4(RGMII0_RXD3) ; port RGMII0_RXD3
NetR464_1: U4.V5(RGMII0_RXCTL) ; port RGMII0_RXCTL
NetR466_1: U4.U5(RGMII0_RXC) ; port RGMII0_RXC
NetR516_1: U4.V2(UART3_RXD/PR1_MII0_RXDV) ; port GPIO5_18
NetR530_2: U4.C25(I2C2_SDA/HDMI1_DDC_SCL) ; port HDMI_DDC_SCL
NetR531_2: U4.F17(I2C2_SCL/HDMI1_DDC_SDA) ; port HDMI_DDC_SDA
NetR577_1: U4.E14(MCASP1_AXR12/PR2_MII0_TXD0) ; port E14_GPIO4_18
NetR578_1: U4.C2(VIN2A_D13/RGMII1_TXCTL) ; port C2_GPIO4_14
NetR607_1: R607.1 U4.A18(MCASP2_FSX/PR2_MII0_RXD1)
NetR607_2: R607.2 ; port MCASP2_FSX
NetR608_1: R608.1 U4.A19(MCASP2_ACLKX/PR2_MII0_RXD2)
NetR608_2: R608.2 ; port MCASP2_ACLKX
NetR617_1: U4.D17(MCASP4_AXR1/SPI3_CS0) ; port D17_UART8_RTSN
NetR627_1: U4.A21(MCASP4_FSX/SPI3_D1) ; port A21_UART8_TXD
NetR630_2: U4.C18(MCASP4_ACLKX/SPI3_SCLK) ; port C18_UART8_RXD
NetR633_1: U4.F12(MCASP1_AXR1/PR2_MII_MT0_CLK) ; port F12_GPIO5_3
NetR636_2: U4.G12(MCASP1_AXR0/PR2_MII0_RXER) ; port G12_GPIO5_2
NetR643_1: U4.A11(MCASP1_AXR9/PR2_MII0_TXD3) ; port A11_SPI3_D1
NetR644_1: U4.D14(MCASP1_FSX/PR2_MDIO_DATA) ; port D14_MCASP1_FSX
NetR645_1: U4.B12(MCASP1_AXR8/PR2_MII0_TXEN) ; port B12_SPI3_SCLK
NetR646_1: U4.C14(MCASP1_ACLKX/PR2_MDIO_MDCLK) ; port C14_MCASP1_ACLKX
NetR668_1: U4.C3(VIN2A_D14/RGMII1_TXD3) ; port C3_GPIO4_15
NetR682_1: U4.A3(VIN2A_D19/RGMII1_RXCTL) ; port A3_GPIO4_27
NetR705_2: U4.B21(SPI1_CS2/HDMI_HPD) ; port HDMI_DDC_HPD
NetU4_AC11: U4.AC11(USB_TXN0) ; port USB_TXN0
NetU4_AD11: U4.AD11(USB_TXP0) ; port USB_TXP0
NetU4_AE12: U4.AE12(USB_RXP0) ; port USB_RXP0
NetU4_AF12: U4.AF12(USB_RXN0) ; port USB_RXN0
NetU4_AG16: U4.AG16(HDMI1_CLOCKX) ; port HDMI_CLKN
NetU4_AG17: U4.AG17(HDMI1_DATA0X) ; port HDMI_DATA0N
NetU4_AG18: U4.AG18(HDMI1_DATA1X) ; port HDMI_DATA1N
NetU4_AG19: U4.AG19(HDMI1_DATA2X) ; port HDMI_DATA2N
NetU4_AH16: U4.AH16(HDMI1_CLOCKY) ; port HDMI_CLKP
NetU4_AH17: U4.AH17(HDMI1_DATA0Y) ; port HDMI_DATA0P
NetU4_AH18: U4.AH18(HDMI1_DATA1Y) ; port HDMI_DATA1P
NetU4_AH19: U4.AH19(HDMI1_DATA2Y) ; port HDMI_DATA2P

Not connected (* = marked no-connect by the designer): U4 A4(VIN2A_D23/RGMII1_RXD0)* A16(MCASP2_AXR3/PR2_MII0_RXLINK)* AA3(MCASP5_ACLKX/PR2_PRU1_R30_1)* AB9(MCASP5_FSX/PR2_PRU1_R31_2)* AF2(VIN1A_D12/GPIO)* AF4(VIN1A_D15/GPIO)* B2(VIN2A_D16/RGMII1_TXD1)* B5(VIN2A_D22/RGMII1_RXD1)* B18(MCASP3_ACLKX/PR2_MII0_CRS)* C4(VIN2A_D15/RGMII1_TXD2)* C15(MCASP2_AXR2/PR2_MII0_RXD0)* F15(MCASP3_FSX/PR2_MII0_COL)*

### Notes on the sheet
- R97 R96 R92 R93 R94 R95 Should close to
  Transmitter(AM572x U4 Side)
- (near U4) differential impedance:90¦¸¡À10 %
  common mode impedance:45¦¸¡À10
- (near U4) USB_RX/USB_TX differential impedance:90¦¸¡À7 %
  USB3.0 (SuperSpeed) Tracelength (Total MAX on PCB):3500 mil
- differential impedance:90¦¸¡À10 %
  common mode impedance:45¦¸¡À10
- (in symbol AM57X, part F) AM57X / RGMII0 /
- (in symbol AM57X, part G) AM57X / RGMII1 /
- (in symbol AM57X, part H) AM57X / HDMI /
- (in symbol AM57X, part I) AM57X / UART3 /
- (in symbol AM57X, part K) AM57X / PRU1_MII0 /
- (in symbol AM57X, part M) AM57X / PRU2_MII0 /
- (in symbol AM57X, part Q) AM57X / USB1 /
- (in symbol AM57X, part S) AM57X / JTAG /
- (in symbol AM57X, part U) AM57X / SPI3 /
- (in symbol AM57X, part 27) AM57X / RS-485 /
- (in symbol AM57X, part 29) AM57X / USB2 /
- (in symbol Embest Title) Title:; Size:; Document Number:; Rev:; Draw By:; Date:; Sheet:; of

### Library data of the parts
R24 R119 = R: as R175 on sheet 09 MMC_UBOOT; Part Type: Thick film Resistor
R92 R94 R97 = R: as R202 on sheet 09 MMC_UBOOT; Part Type: Thick film Resistor
R93 R95 R96 R199 R200 = R: RES,22R,+/-5%,1/16W,SMD0402; Manufacturer Part Number: RC0402JR-0722RL; Manufacturer: YAGEO; Embest PN: 1003001100007; Part Type: Thick film Resistor
R112 = R: as R176 on sheet 09 MMC_UBOOT; Part Type: Thick film Resistor
R134 = R: RES,1K5,+/-5%,1/16W,SMD0402; Manufacturer Part Number: RC0402JR-071K5L; Manufacturer: YAGEO; Embest PN: 1003001100038; Part Type: Thick film Resistor
R180 R189 = R: RES,4K7,+/-5%,1/16W,SMD0402; Manufacturer Part Number: RC0402JR-074K7L; Manufacturer: YAGEO; Embest PN: 1003001100057; Part Type: Thick film Resistor
R192 = R: RES,4K7,+/-5%,1/16W,SMD0402; Manufacturer: YAGEO; Manufacturer Part Number: RC0402JR-074K7L; Embest PN: 1003001100057; Part Type: Thick film Resistor
R607 R608 = R: as R583 on sheet 09 MMC_UBOOT; Part Type: Thick film Resistor
U4 = AM57X: as U4 on sheet 09 MMC_UBOOT; Part Type: MPU; Manufacturer: TI; Manufacturer Part Number: AM5729BABCXEAR; Status: BeagleBone AI
*#8 = Embest Title: Page Create Date: May 29, 2006; WebSite: http://www.embest-tech.com; Company: Embest; Page Modify Date: *

## Sheet 11 AM572x Interface 2.SchDoc
size 420 x 297 mm
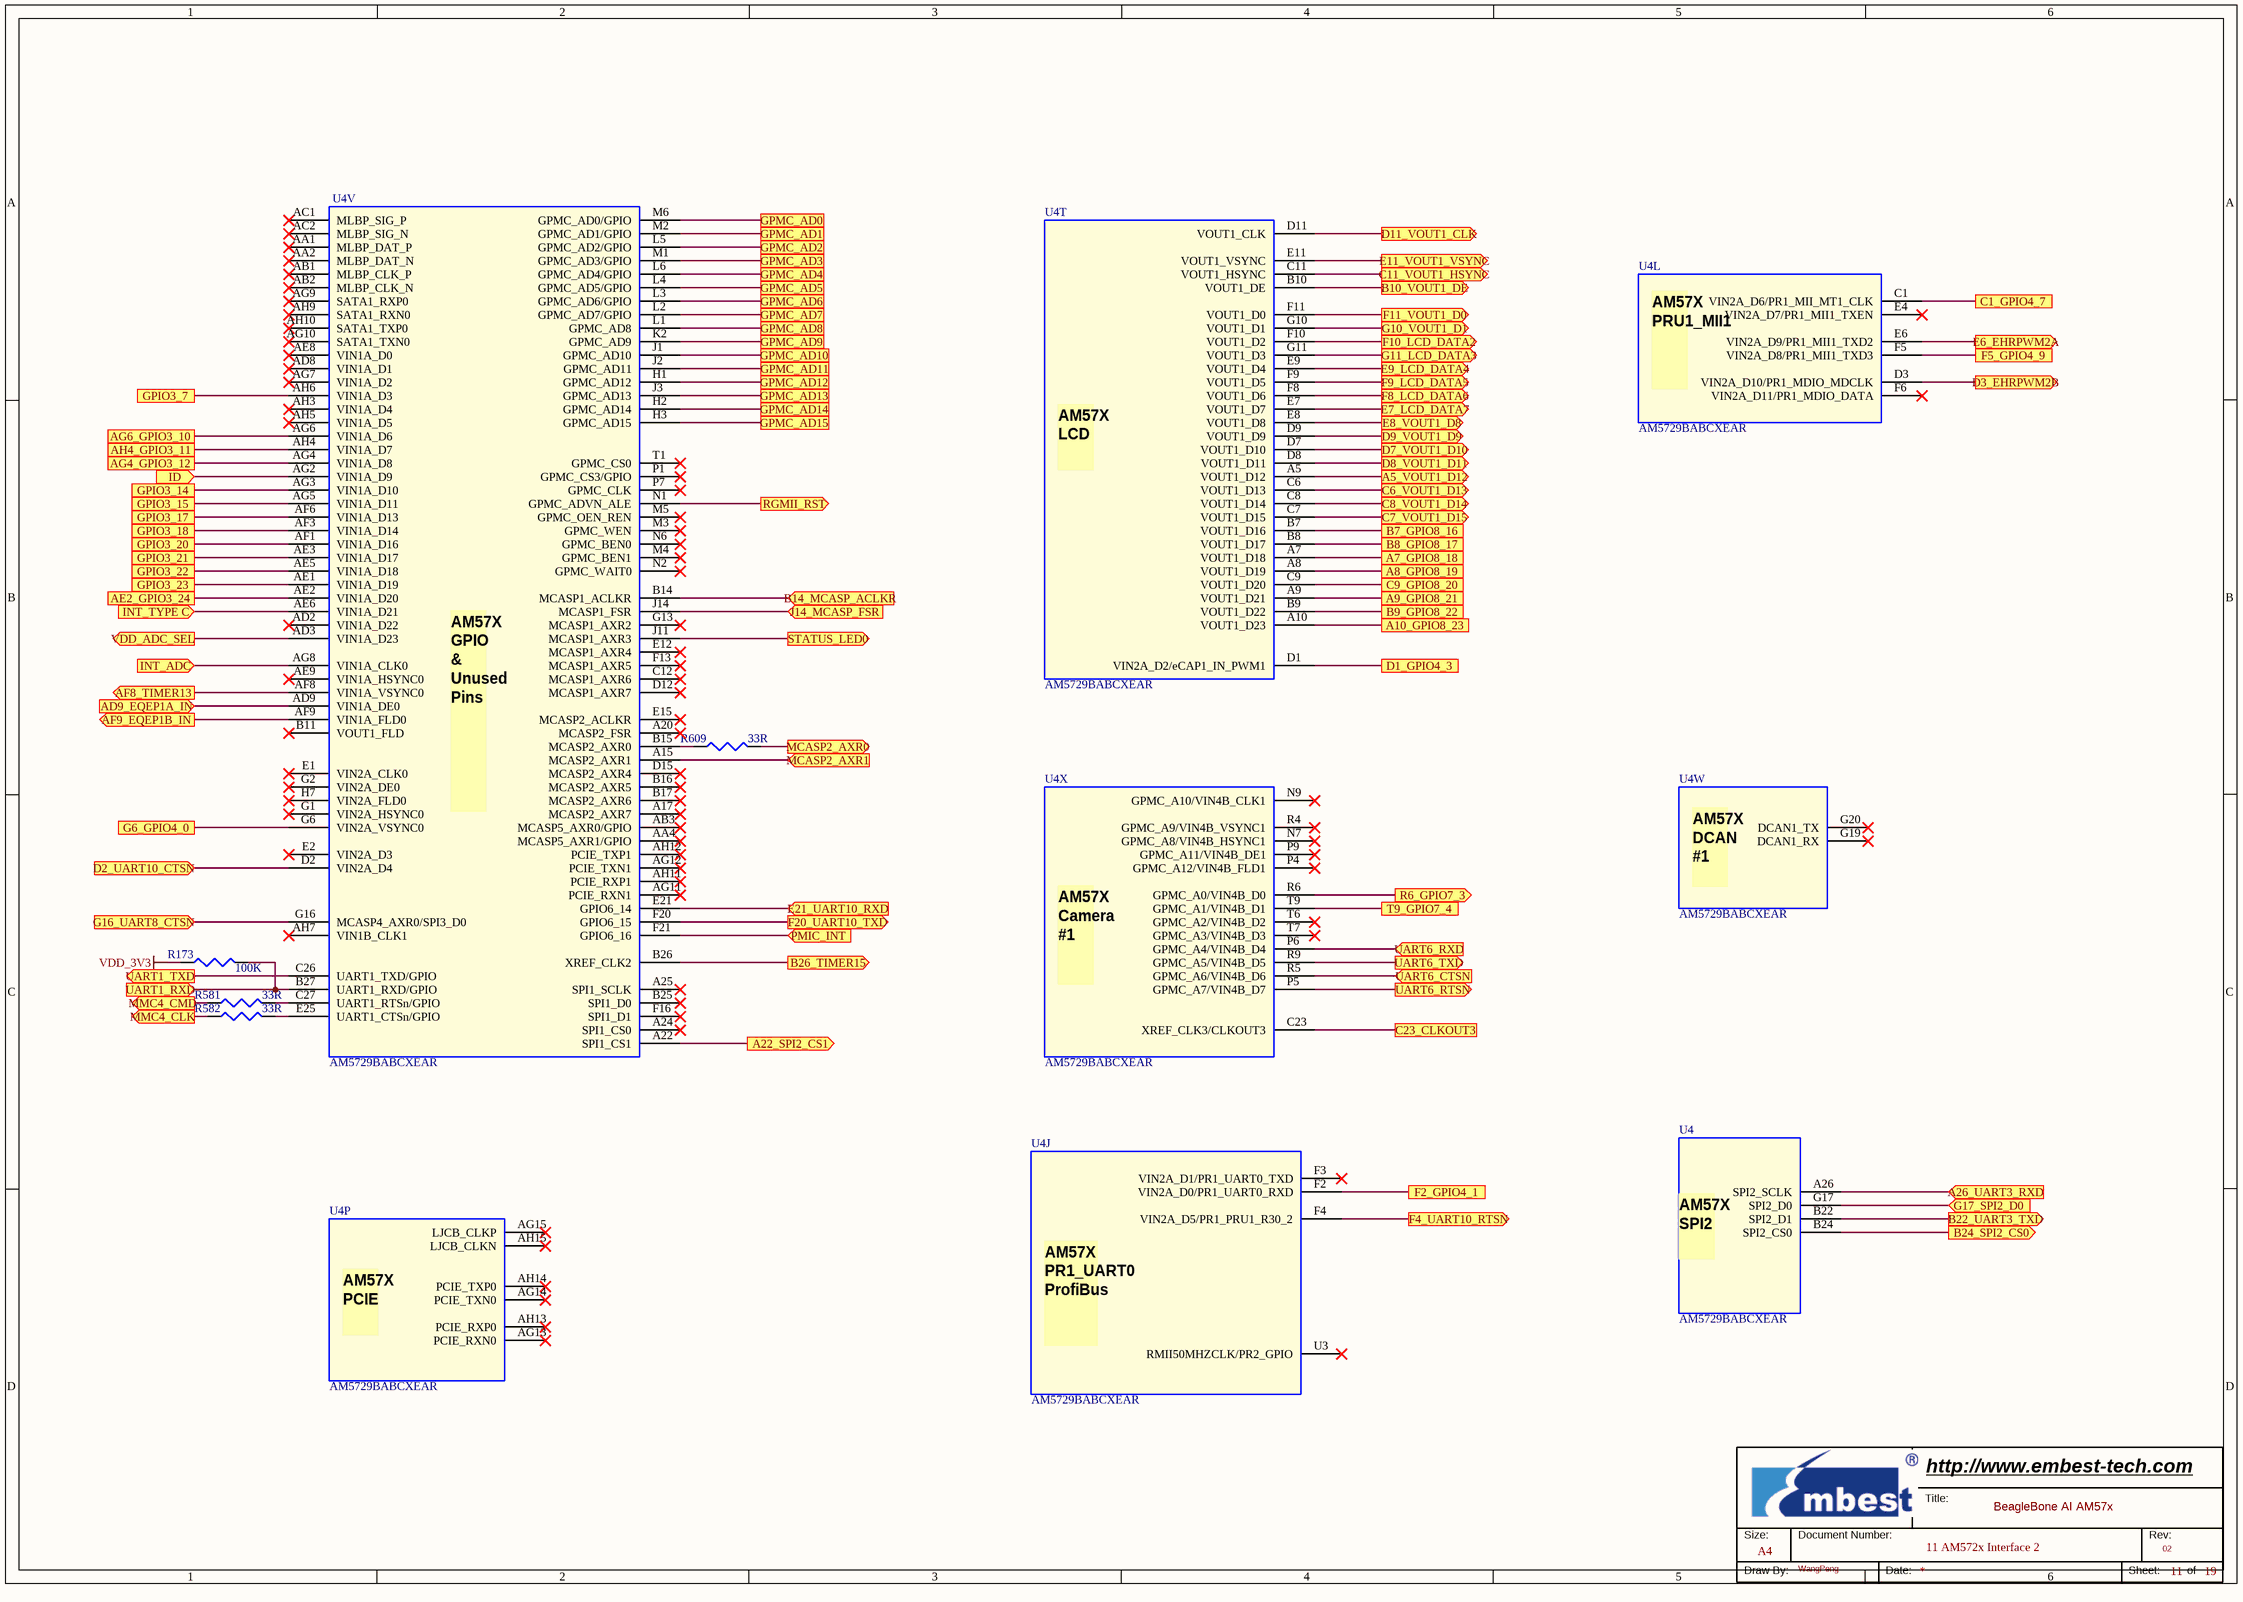
[diagram p9: 11 AM572x Interface 2.SchDoc]

### Parts
(Parts that share a designator on the sheet are numbered #1, #2 ... from top to bottom, then left to right.)
*#9  Page Count: 19  Page Number: 11  Page Size: A4  Title: BeagleBone AI AM57x  RevCode: 02  Doc: 11 AM572x Interface 2  Drawing: WangPeng  (hidden comment: Embest Title)  (graphical)
R173  100K  [R0402]
R581  33R  [R0402]
R582  33R  [R0402]
R609  33R  [R0402]
U4  AM5729BABCXEAR  [BGA23X23-760-117M]  (parts J,L,P,T,V,W,X,28 of 29)

### Ports
A5_VOUT1_D12 (out), A7_GPIO8_18, A8_GPIO8_19, A9_GPIO8_21, A10_GPIO8_23, A22_SPI2_CS1 (out), A26_UART3_RXD (in), AD9_EQEP1A_IN (in), AE2_GPIO3_24, AF8_TIMER13 (out), AF9_EQEP1B_IN (out), AG4_GPIO3_12, AG6_GPIO3_10, AH4_GPIO3_11, B7_GPIO8_16, B8_GPIO8_17, B9_GPIO8_22, B10_VOUT1_DE (out), B14_MCASP_ACLKR (in), B22_UART3_TXD (out), B24_SPI2_CS0 (out), B26_TIMER15 (out), C1_GPIO4_7, C6_VOUT1_D13 (out), C7_VOUT1_D15 (out), C8_VOUT1_D14 (out), C9_GPIO8_20, C11_VOUT1_HSYNC (out), C23_CLKOUT3, D1_GPIO4_3, D2_UART10_CTSN (in), D3_EHRPWM2B (out), D7_VOUT1_D10 (out), D8_VOUT1_D11 (out), D9_VOUT1_D9 (out), D11_VOUT1_CLK (out), E6_EHRPWM2A (out), E7_LCD_DATA7 (out), E8_VOUT1_D8 (out), E9_LCD_DATA4 (out), E11_VOUT1_VSYNC (out), E21_UART10_RXD (in), F2_GPIO4_1, F4_UART10_RTSN (out), F5_GPIO4_9, F8_LCD_DATA6 (out), F9_LCD_DATA5 (out), F10_LCD_DATA2 (out), F11_VOUT1_D0 (out), F20_UART10_TXD (out), G6_GPIO4_0, G10_VOUT1_D1 (out), G11_LCD_DATA3 (out), G16_UART8_CTSN (in), G17_SPI2_D0 (in), GPIO3_7, GPIO3_14, GPIO3_15, GPIO3_17, GPIO3_18, GPIO3_20, GPIO3_21, GPIO3_22, GPIO3_23, GPMC_AD0, GPMC_AD1, GPMC_AD2, GPMC_AD3, GPMC_AD4, GPMC_AD5, GPMC_AD6, GPMC_AD7, GPMC_AD8, GPMC_AD9, GPMC_AD10, GPMC_AD11, GPMC_AD12, GPMC_AD13, GPMC_AD14, GPMC_AD15, ID (in), INT_ADC (in), INT_TYPE C (in), J14_MCASP_FSR (in), MCASP2_AXR0 (out), MCASP2_AXR1 (in), MMC4_CLK (out), MMC4_CMD (out), PMIC_INT (in), R6_GPIO7_3 (out), RGMII_RST (out), STATUS_LED0 (out), T9_GPIO7_4, UART1_RXD (in), UART1_TXD (out), UART6_CTSN (in), UART6_RTSN (out), UART6_RXD (in), UART6_TXD (out), VDD_ADC_SEL (out)

### Nets
VDD_3V3: R173.1
GPMC_AD0: U4.M6(GPMC_AD0/GPIO) ; port GPMC_AD0
GPMC_AD1: U4.M2(GPMC_AD1/GPIO) ; port GPMC_AD1
GPMC_AD2: U4.L5(GPMC_AD2/GPIO) ; port GPMC_AD2
GPMC_AD3: U4.M1(GPMC_AD3/GPIO) ; port GPMC_AD3
GPMC_AD4: U4.L6(GPMC_AD4/GPIO) ; port GPMC_AD4
GPMC_AD5: U4.L4(GPMC_AD5/GPIO) ; port GPMC_AD5
GPMC_AD6: U4.L3(GPMC_AD6/GPIO) ; port GPMC_AD6
GPMC_AD7: U4.L2(GPMC_AD7/GPIO) ; port GPMC_AD7
GPMC_AD8: U4.L1(GPMC_AD8) ; port GPMC_AD8
GPMC_AD9: U4.K2(GPMC_AD9) ; port GPMC_AD9
GPMC_AD10: U4.J1(GPMC_AD10) ; port GPMC_AD10
GPMC_AD11: U4.J2(GPMC_AD11) ; port GPMC_AD11
GPMC_AD12: U4.H1(GPMC_AD12) ; port GPMC_AD12
GPMC_AD13: U4.J3(GPMC_AD13) ; port GPMC_AD13
GPMC_AD14: U4.H2(GPMC_AD14) ; port GPMC_AD14
GPMC_AD15: U4.H3(GPMC_AD15) ; port GPMC_AD15
Netp8_11: U4.AH4(VIN1A_D7) ; port AH4_GPIO3_11
Netp8_12: U4.AG6(VIN1A_D6) ; port AG6_GPIO3_10
Netp8_13: U4.D3(VIN2A_D10/PR1_MDIO_MDCLK) ; port D3_EHRPWM2B
Netp8_17: U4.A7(VOUT1_D18) ; port A7_GPIO8_18
Netp8_18: U4.F5(VIN2A_D8/PR1_MII1_TXD3) ; port F5_GPIO4_9
Netp8_19: U4.E6(VIN2A_D9/PR1_MII1_TXD2) ; port E6_EHRPWM2A
Netp8_39: U4.F8(VOUT1_D6) ; port F8_LCD_DATA6
Netp8_40: U4.E7(VOUT1_D7) ; port E7_LCD_DATA7
Netp8_41: U4.E9(VOUT1_D4) ; port E9_LCD_DATA4
Netp8_42: U4.F9(VOUT1_D5) ; port F9_LCD_DATA5
Netp8_43: U4.F10(VOUT1_D2) ; port F10_LCD_DATA2
Netp8_44: U4.G11(VOUT1_D3) ; port G11_LCD_DATA3
Netp9_12: U4.B14(MCASP1_ACLKR) ; port B14_MCASP_ACLKR
Netp9_15: U4.AG4(VIN1A_D8) ; port AG4_GPIO3_12
Netp9_23: U4.A22(SPI1_CS1) ; port A22_SPI2_CS1
Netp9_24: U4.F20(GPIO6_15) ; port F20_UART10_TXD
NetQ17_1: U4.AD3(VIN1A_D23) ; port VDD_ADC_SEL
NetQ18_1: U4.AH6(VIN1A_D3) ; port GPIO3_7
NetR152_2: U4.F21(GPIO6_16) ; port PMIC_INT
NetR173_2: R173.2 U4.B27(UART1_RXD/GPIO) ; port UART1_RXD
NetR387_1: U4.AG3(VIN1A_D10) ; port GPIO3_14
NetR389_1: U4.AG5(VIN1A_D11) ; port GPIO3_15
NetR390_1: U4.J11(MCASP1_AXR3) ; port STATUS_LED0
NetR392_1: U4.AF6(VIN1A_D13) ; port GPIO3_17
NetR413_2: U4.R5(GPMC_A6/VIN4B_D6) ; port UART6_CTSN
NetR545_1: U4.AE6(VIN1A_D21) ; port INT_TYPE C
NetR546_2: U4.AG2(VIN1A_D9) ; port ID
NetR560_2: U4.P5(GPMC_A7/VIN4B_D7) ; port UART6_RTSN
NetR567_2: U4.AG8(VIN1A_CLK0) ; port INT_ADC
NetR579_1: U4.C23(XREF_CLK3/CLKOUT3) ; port C23_CLKOUT3
NetR580_2: U4.C1(VIN2A_D6/PR1_MII_MT1_CLK) ; port C1_GPIO4_7
NetR581_1: R581.1 ; port MMC4_CMD
NetR581_2: R581.2 U4.C27(UART1_RTSn/GPIO)
NetR582_1: R582.1 ; port MMC4_CLK
NetR582_2: R582.2 U4.E25(UART1_CTSn/GPIO)
NetR609_1: R609.1 U4.B15(MCASP2_AXR0)
NetR609_2: R609.2 ; port MCASP2_AXR0
NetR610_2: U4.A15(MCASP2_AXR1) ; port MCASP2_AXR1
NetR614_1: U4.C6(VOUT1_D13) ; port C6_VOUT1_D13
NetR615_1: U4.AF9(VIN1A_FLD0) ; port AF9_EQEP1B_IN
NetR616_1: U4.C7(VOUT1_D15) ; port C7_VOUT1_D15
NetR618_2: U4.G16(MCASP4_AXR0/SPI3_D0) ; port G16_UART8_CTSN
NetR619_1: U4.C8(VOUT1_D14) ; port C8_VOUT1_D14
NetR620_1: U4.B10(VOUT1_DE) ; port B10_VOUT1_DE
NetR621_1: U4.B9(VOUT1_D22) ; port B9_GPIO8_22
NetR622_1: U4.D11(VOUT1_CLK) ; port D11_VOUT1_CLK
NetR623_1: U4.C9(VOUT1_D20) ; port C9_GPIO8_20
NetR624_2: U4.A9(VOUT1_D21) ; port A9_GPIO8_21
NetR625_1: U4.C11(VOUT1_HSYNC) ; port C11_VOUT1_HSYNC
NetR626_1: U4.E8(VOUT1_D8) ; port E8_VOUT1_D8
NetR628_1: U4.A5(VOUT1_D12) ; port A5_VOUT1_D12
NetR629_1: U4.AD9(VIN1A_DE0) ; port AD9_EQEP1A_IN
NetR631_1: U4.D9(VOUT1_D9) ; port D9_VOUT1_D9
NetR632_1: U4.B24(SPI2_CS0) ; port B24_SPI2_CS0
NetR634_1: U4.R6(GPMC_A0/VIN4B_D0) ; port R6_GPIO7_3
NetR635_1: U4.F4(VIN2A_D5/PR1_PRU1_R30_2) ; port F4_UART10_RTSN
NetR637_1: U4.G17(SPI2_D0) ; port G17_SPI2_D0
NetR638_1: U4.T9(GPMC_A1/VIN4B_D1) ; port T9_GPIO7_4
NetR639_1: U4.D2(VIN2A_D4) ; port D2_UART10_CTSN
NetR652_1: U4.E21(GPIO6_14) ; port E21_UART10_RXD
NetR653_1: U4.AE2(VIN1A_D20) ; port AE2_GPIO3_24
NetR662_1: U4.F11(VOUT1_D0) ; port F11_VOUT1_D0
NetR663_1: U4.B7(VOUT1_D16) ; port B7_GPIO8_16
NetR664_1: U4.G10(VOUT1_D1) ; port G10_VOUT1_D1
NetR665_1: U4.A10(VOUT1_D23) ; port A10_GPIO8_23
NetR666_1: U4.E11(VOUT1_VSYNC) ; port E11_VOUT1_VSYNC
NetR667_1: U4.A8(VOUT1_D19) ; port A8_GPIO8_19
NetR669_1: U4.J14(MCASP1_FSR) ; port J14_MCASP_FSR
NetR681_1: U4.D1(VIN2A_D2/eCAP1_IN_PWM1) ; port D1_GPIO4_3
NetR683_1: U4.D8(VOUT1_D11) ; port D8_VOUT1_D11
NetR684_1: U4.G6(VIN2A_VSYNC0) ; port G6_GPIO4_0
NetR685_1: U4.D7(VOUT1_D10) ; port D7_VOUT1_D10
NetR686_1: U4.F2(VIN2A_D0/PR1_UART0_RXD) ; port F2_GPIO4_1
NetR688_1: U4.B8(VOUT1_D17) ; port B8_GPIO8_17
NetR694_1: U4.AF8(VIN1A_VSYNC0) ; port AF8_TIMER13
NetR695_1: U4.B22(SPI2_D1) ; port B22_UART3_TXD
NetR696_1: U4.B26(XREF_CLK2) ; port B26_TIMER15
NetR697_1: U4.A26(SPI2_SCLK) ; port A26_UART3_RXD
NetR698_2: U4.N1(GPMC_ADVN_ALE) ; port RGMII_RST
NetU4_AE1: U4.AE1(VIN1A_D19) ; port GPIO3_23
NetU4_AE3: U4.AE3(VIN1A_D17) ; port GPIO3_21
NetU4_AE5: U4.AE5(VIN1A_D18) ; port GPIO3_22
NetU4_AF1: U4.AF1(VIN1A_D16) ; port GPIO3_20
NetU4_AF3: U4.AF3(VIN1A_D14) ; port GPIO3_18
NetU4_C26: U4.C26(UART1_TXD/GPIO) ; port UART1_TXD
NetU4_P6: U4.P6(GPMC_A4/VIN4B_D4) ; port UART6_RXD
NetU4_R9: U4.R9(GPMC_A5/VIN4B_D5) ; port UART6_TXD

Not connected (* = marked no-connect by the designer): U4 A17(MCASP2_AXR7)* A20(MCASP2_FSR)* A24(SPI1_CS0)* A25(SPI1_SCLK)* AA1(MLBP_DAT_P)* AA2(MLBP_DAT_N)* AA4(MCASP5_AXR1/GPIO)* AB1(MLBP_CLK_P)* AB2(MLBP_CLK_N)* AB3(MCASP5_AXR0/GPIO)* AC1(MLBP_SIG_P)* AC2(MLBP_SIG_N)* AD2(VIN1A_D22)* AD8(VIN1A_D1)* AE8(VIN1A_D0)* AE9(VIN1A_HSYNC0)* AG7(VIN1A_D2)* AG9(SATA1_RXP0)* AG10(SATA1_TXN0)* AG11(PCIE_RXN1)* AG12(PCIE_TXN1)* AG13(PCIE_RXN0)* AG14(PCIE_TXN0)* AG15(LJCB_CLKP)* AH3(VIN1A_D4)* AH5(VIN1A_D5)* AH7(VIN1B_CLK1)* AH9(SATA1_RXN0)* AH10(SATA1_TXP0)* AH11(PCIE_RXP1)* AH12(PCIE_TXP1)* AH13(PCIE_RXP0)* AH14(PCIE_TXP0)* AH15(LJCB_CLKN)* B11(VOUT1_FLD)* B16(MCASP2_AXR5)* B17(MCASP2_AXR6)* B25(SPI1_D0)* C12(MCASP1_AXR6)* D12(MCASP1_AXR7)* D15(MCASP2_AXR4)* E1(VIN2A_CLK0)* E2(VIN2A_D3)* E4(VIN2A_D7/PR1_MII1_TXEN)* E12(MCASP1_AXR4)* E15(MCASP2_ACLKR)* F3(VIN2A_D1/PR1_UART0_TXD)* F6(VIN2A_D11/PR1_MDIO_DATA)* F13(MCASP1_AXR5)* F16(SPI1_D1)* G1(VIN2A_HSYNC0)* G2(VIN2A_DE0)* G13(MCASP1_AXR2)* G19(DCAN1_RX)* G20(DCAN1_TX)* H7(VIN2A_FLD0)* M3(GPMC_WEN)* M4(GPMC_BEN1)* M5(GPMC_OEN_REN)* N2(GPMC_WAIT0)* N6(GPMC_BEN0)* N7(GPMC_A8/VIN4B_HSYNC1)* N9(GPMC_A10/VIN4B_CLK1)* P1(GPMC_CS3/GPIO)* P4(GPMC_A12/VIN4B_FLD1)* P7(GPMC_CLK)* P9(GPMC_A11/VIN4B_DE1)* R4(GPMC_A9/VIN4B_VSYNC1)* T1(GPMC_CS0)* T6(GPMC_A2/VIN4B_D2)* T7(GPMC_A3/VIN4B_D3)* U3(RMII50MHZCLK/PR2_GPIO)*

### Notes on the sheet
- (in symbol AM57X, part J) AM57X / PR1_UART0 / ProfiBus /
- (in symbol AM57X, part L) AM57X / PRU1_MII1 /
- (in symbol AM57X, part P) AM57X / PCIE /
- (in symbol AM57X, part T) AM57X / LCD /
- (in symbol AM57X, part V) AM57X GPIO & Unused / Pins /
- (in symbol AM57X, part W) AM57X / DCAN #1 /
- (in symbol AM57X, part X) AM57X / Camera #1 /
- (in symbol AM57X, part 28) AM57X / SPI2 /
- (in symbol Embest Title) Title:; Size:; Document Number:; Rev:; Draw By:; Date:; Sheet:; of

### Library data of the parts
R173 = R: as R164 on sheet 09 MMC_UBOOT; Part Type: Thick film Resistor
R581 R582 = R: as R583 on sheet 09 MMC_UBOOT; Part Type: Thick film Resistor
R609 = R: RES,33R,+/-5%,1/16W,SMD0402; Manufacturer: YAGEO; Manufacturer Part Number: RC0402JR-0733RL; Embest PN: 1003001100010; Part Type: Thick film Resistor
U4 = AM57X: as U4 on sheet 09 MMC_UBOOT; Part Type: MPU; Manufacturer: TI; Manufacturer Part Number: AM5729BABCXEAR; Status: BeagleBone AI
*#9 = Embest Title: Page Create Date: May 29, 2006; WebSite: http://www.embest-tech.com; Company: Embest; Page Modify Date: *

## Sheet 12 Processor  Power.SchDoc
size 594 x 420 mm
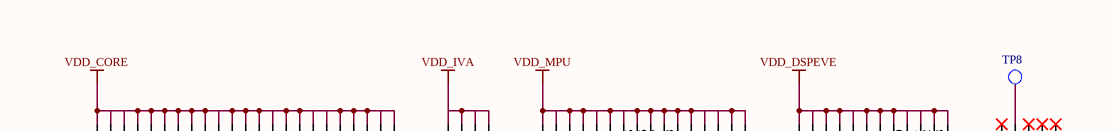
[diagram p10: 12 Processor  Power.SchDoc, top left]
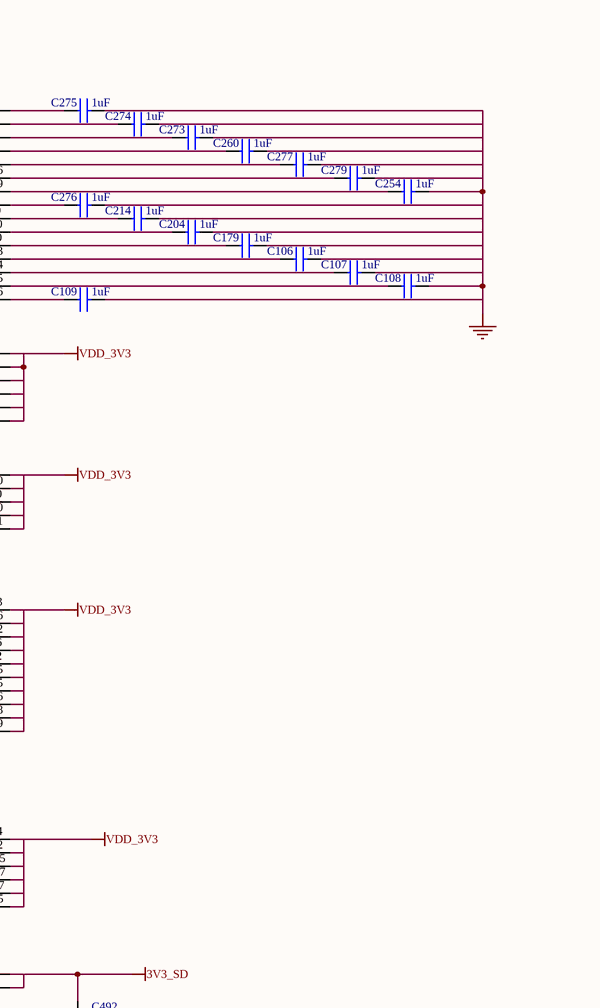
[diagram p11: 12 Processor  Power.SchDoc, top right]
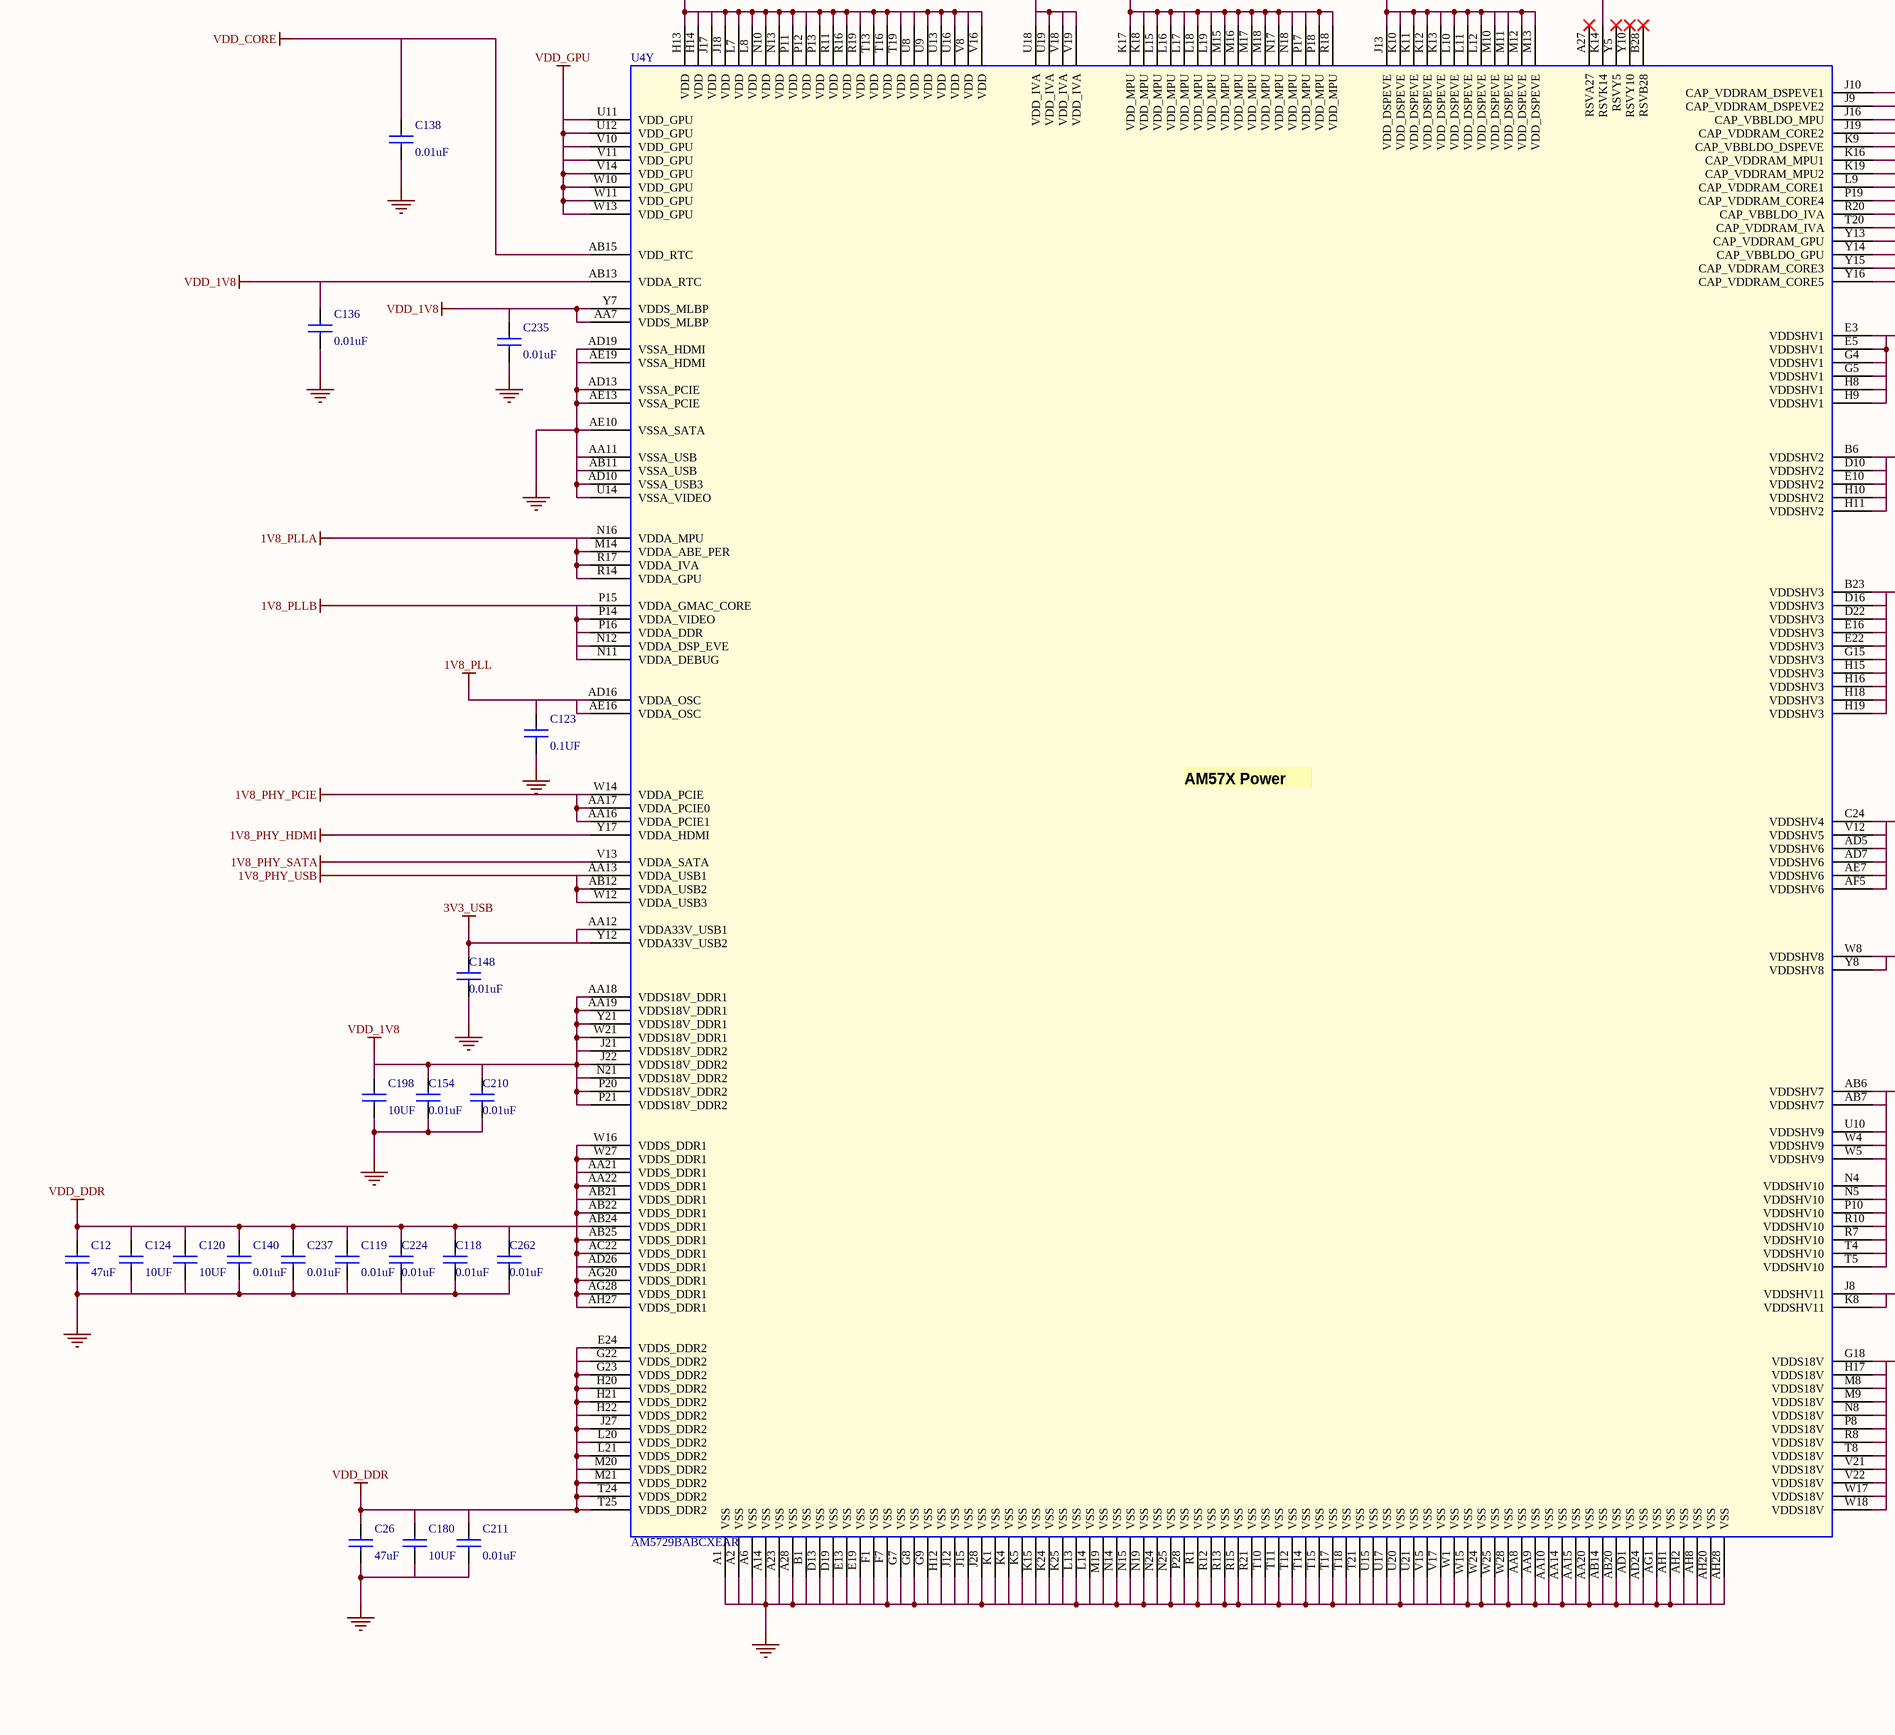
[diagram p12: 12 Processor  Power.SchDoc, bottom left]
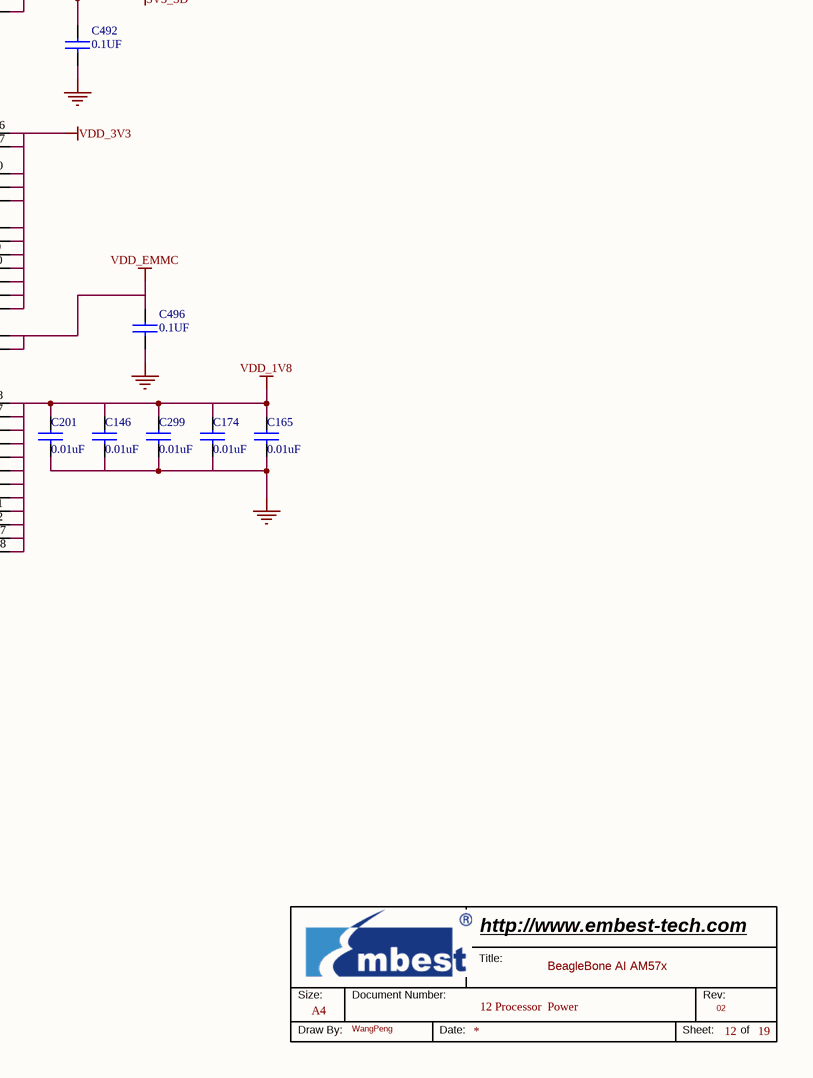
[diagram p13: 12 Processor  Power.SchDoc, bottom right]

### Parts
(Parts that share a designator on the sheet are numbered #1, #2 ... from top to bottom, then left to right.)
*#10  Page Count: 19  Page Number: 12  Page Size: A4  Title: BeagleBone AI AM57x  RevCode: 02  Doc: 12 Processor  Power  Drawing: WangPeng  (hidden comment: Embest Title)  (graphical)
C12  47uF  [C0805]
C26  47uF  [C0805]
C106  1uF  [C0402]
C107  1uF  [C0402]
C108  1uF  [C0402]
C109  1uF  [C0402]
C118  0.01uF  [C0402]
C119  0.01uF  [C0402]
C120  10UF  [C0603]
C123  0.1UF  [C0402]
C124  10UF  [C0603]
C136  0.01uF  [C0402]
C138  0.01uF  [C0402]
C140  0.01uF  [C0402]
C146  0.01uF  [C0402]
C148  0.01uF  [C0402]
C154  0.01uF  [C0402]
C165  0.01uF  [C0402]
C174  0.01uF  [C0402]
C179  1uF  [C0402]
C180  10UF  [C0603]
C198  10UF  [C0603]
C201  0.01uF  [C0402]
C204  1uF  [C0402]
C210  0.01uF  [C0402]
C211  0.01uF  [C0402]
C214  1uF  [C0402]
C224  0.01uF  [C0402]
C235  0.01uF  [C0402]
C237  0.01uF  [C0402]
C254  1uF  [C0402]
C260  1uF  [C0402]
C262  0.01uF  [C0402]
C273  1uF  [C0402]
C274  1uF  [C0402]
C275  1uF  [C0402]
C276  1uF  [C0402]
C277  1uF  [C0402]
C279  1uF  [C0402]
C299  0.01uF  [C0402]
C492  0.1UF  [C0402]
C496  0.1UF  [C0402]
TP8  NI  [TP1-8040]  (value not drawn)
U4  AM5729BABCXEAR  [BGA23X23-760-117M]  (part Y of 29)

### Nets
1V8_PHY_HDMI: U4.Y17(VDDA_HDMI)
1V8_PHY_PCIE: U4.AA16(VDDA_PCIE1) U4.AA17(VDDA_PCIE0) U4.W14(VDDA_PCIE)
1V8_PHY_SATA: U4.V13(VDDA_SATA)
1V8_PHY_USB: U4.AA13(VDDA_USB1) U4.AB12(VDDA_USB2) U4.W12(VDDA_USB3)
1V8_PLL: C123.1 U4.AD16(VDDA_OSC) U4.AE16(VDDA_OSC)
1V8_PLLA: U4.M14(VDDA_ABE_PER) U4.N16(VDDA_MPU) U4.R14(VDDA_GPU) U4.R17(VDDA_IVA)
1V8_PLLB: U4.N11(VDDA_DEBUG) U4.N12(VDDA_DSP_EVE) U4.P14(VDDA_VIDEO) U4.P15(VDDA_GMAC_CORE) U4.P16(VDDA_DDR)
3V3_SD: C492.1 U4.W8(VDDSHV8) U4.Y8(VDDSHV8)
3V3_USB: C148.1 U4.AA12(VDDA33V_USB1) U4.Y12(VDDA33V_USB2)
GND: C12.2 C26.2 C106.2 C107.2 C108.2 C109.2 C118.2 C119.2 C120.2 C123.2 C124.2 C136.2 C138.2 C140.2 C146.2 C148.2 C154.2 C165.2 C174.2 C179.2 C180.2 C198.2 C201.2 C204.2 C210.2 C211.2 C214.2 C224.2 C235.2 C237.2 C254.2 C260.2 C262.2 C273.2 C274.2 C275.2 C276.2 C277.2 C279.2 C299.2 C492.2 C496.2 U4.A1(VSS) U4.A2(VSS) U4.A6(VSS) U4.A14(VSS) U4.A23(VSS) U4.A28(VSS) U4.AA8(VSS) U4.AA9(VSS) U4.AA10(VSS) U4.AA11(VSSA_USB) U4.AA14(VSS) U4.AA15(VSS) U4.AA20(VSS) U4.AB11(VSSA_USB) U4.AB14(VSS) U4.AB20(VSS) U4.AD1(VSS) U4.AD10(VSSA_USB3) U4.AD13(VSSA_PCIE) U4.AD19(VSSA_HDMI) U4.AD24(VSS) U4.AE10(VSSA_SATA) U4.AE13(VSSA_PCIE) U4.AE19(VSSA_HDMI) U4.AG1(VSS) U4.AH1(VSS) U4.AH2(VSS) U4.AH8(VSS) U4.AH20(VSS) U4.AH28(VSS) U4.B1(VSS) U4.D13(VSS) U4.D19(VSS) U4.E13(VSS) U4.E19(VSS) U4.F1(VSS) U4.F7(VSS) U4.G7(VSS) U4.G8(VSS) U4.G9(VSS) U4.H12(VSS) U4.J12(VSS) U4.J15(VSS) U4.J28(VSS) U4.K1(VSS) U4.K4(VSS) U4.K5(VSS) U4.K15(VSS) U4.K24(VSS) U4.K25(VSS) U4.L13(VSS) U4.L14(VSS) U4.M19(VSS) U4.N14(VSS) U4.N15(VSS) U4.N19(VSS) U4.N24(VSS) U4.N25(VSS) U4.P28(VSS) U4.R1(VSS) U4.R12(VSS) U4.R13(VSS) U4.R15(VSS) U4.R21(VSS) U4.T10(VSS) U4.T11(VSS) U4.T12(VSS) U4.T14(VSS) U4.T15(VSS) U4.T17(VSS) U4.T18(VSS) U4.T21(VSS) U4.U14(VSSA_VIDEO) U4.U15(VSS) U4.U17(VSS) U4.U20(VSS) U4.U21(VSS) U4.V15(VSS) U4.V17(VSS) U4.W1(VSS) U4.W15(VSS) U4.W24(VSS) U4.W25(VSS) U4.W28(VSS)  [project net DDR1_RST]
VDD_1V8: C136.1 C146.1 C154.1 C165.1 C174.1 C198.1 C201.1 C210.1 C235.1 C299.1 U4.AA7(VDDS_MLBP) U4.AA18(VDDS18V_DDR1) U4.AA19(VDDS18V_DDR1) U4.AB13(VDDA_RTC) U4.G18(VDDS18V) U4.H17(VDDS18V) U4.J21(VDDS18V_DDR2) U4.J22(VDDS18V_DDR2) U4.M8(VDDS18V) U4.M9(VDDS18V) U4.N8(VDDS18V) U4.N21(VDDS18V_DDR2) U4.P8(VDDS18V) U4.P20(VDDS18V_DDR2) U4.P21(VDDS18V_DDR2) U4.R8(VDDS18V) U4.T8(VDDS18V) U4.V21(VDDS18V) U4.V22(VDDS18V) U4.W17(VDDS18V) U4.W18(VDDS18V) U4.W21(VDDS18V_DDR1) U4.Y7(VDDS_MLBP) U4.Y21(VDDS18V_DDR1)
VDD_3V3: U4.AB6(VDDSHV7) U4.AB7(VDDSHV7) U4.AD5(VDDSHV6) U4.AD7(VDDSHV6) U4.AE7(VDDSHV6) U4.AF5(VDDSHV6) U4.B6(VDDSHV2) U4.B23(VDDSHV3) U4.C24(VDDSHV4) U4.D10(VDDSHV2) U4.D16(VDDSHV3) U4.D22(VDDSHV3) U4.E3(VDDSHV1) U4.E5(VDDSHV1) U4.E10(VDDSHV2) U4.E16(VDDSHV3) U4.E22(VDDSHV3) U4.G4(VDDSHV1) U4.G5(VDDSHV1) U4.G15(VDDSHV3) U4.H8(VDDSHV1) U4.H9(VDDSHV1) U4.H10(VDDSHV2) U4.H11(VDDSHV2) U4.H15(VDDSHV3) U4.H16(VDDSHV3) U4.H18(VDDSHV3) U4.H19(VDDSHV3) U4.N4(VDDSHV10) U4.N5(VDDSHV10) U4.P10(VDDSHV10) U4.R7(VDDSHV10) U4.R10(VDDSHV10) U4.T4(VDDSHV10) U4.T5(VDDSHV10) U4.U10(VDDSHV9) U4.V12(VDDSHV5) U4.W4(VDDSHV9) U4.W5(VDDSHV9)
VDD_CORE: C138.1 U4.AB15(VDD_RTC) U4.H13(VDD) U4.H14(VDD) U4.J17(VDD) U4.J18(VDD) U4.L7(VDD) U4.L8(VDD) U4.N10(VDD) U4.N13(VDD) U4.P11(VDD) U4.P12(VDD) U4.P13(VDD) U4.R11(VDD) U4.R16(VDD) U4.R19(VDD) U4.T13(VDD) U4.T16(VDD) U4.T19(VDD) U4.U8(VDD) U4.U9(VDD) U4.U13(VDD) U4.U16(VDD) U4.V8(VDD) U4.V16(VDD)
VDD_DDR: C12.1 C26.1 C118.1 C119.1 C120.1 C124.1 C140.1 C180.1 C211.1 C224.1 C237.1 C262.1 U4.AA21(VDDS_DDR1) U4.AA22(VDDS_DDR1) U4.AB21(VDDS_DDR1) U4.AB22(VDDS_DDR1) U4.AB24(VDDS_DDR1) U4.AB25(VDDS_DDR1) U4.AC22(VDDS_DDR1) U4.AD26(VDDS_DDR1) U4.AG20(VDDS_DDR1) U4.AG28(VDDS_DDR1) U4.AH27(VDDS_DDR1) U4.E24(VDDS_DDR2) U4.G22(VDDS_DDR2) U4.G23(VDDS_DDR2) U4.H20(VDDS_DDR2) U4.H21(VDDS_DDR2) U4.H22(VDDS_DDR2) U4.J27(VDDS_DDR2) U4.L20(VDDS_DDR2) U4.L21(VDDS_DDR2) U4.M20(VDDS_DDR2) U4.M21(VDDS_DDR2) U4.T24(VDDS_DDR2) U4.T25(VDDS_DDR2) U4.W16(VDDS_DDR1) U4.W27(VDDS_DDR1)
VDD_DSPEVE: U4.J13(VDD_DSPEVE) U4.K10(VDD_DSPEVE) U4.K11(VDD_DSPEVE) U4.K12(VDD_DSPEVE) U4.K13(VDD_DSPEVE) U4.L10(VDD_DSPEVE) U4.L11(VDD_DSPEVE) U4.L12(VDD_DSPEVE) U4.M10(VDD_DSPEVE) U4.M11(VDD_DSPEVE) U4.M12(VDD_DSPEVE) U4.M13(VDD_DSPEVE)
VDD_EMMC: C496.1 U4.J8(VDDSHV11) U4.K8(VDDSHV11)
VDD_GPU: U4.U11(VDD_GPU) U4.U12(VDD_GPU) U4.V10(VDD_GPU) U4.V11(VDD_GPU) U4.V14(VDD_GPU) U4.W10(VDD_GPU) U4.W11(VDD_GPU) U4.W13(VDD_GPU)
VDD_IVA: U4.U18(VDD_IVA) U4.U19(VDD_IVA) U4.V18(VDD_IVA) U4.V19(VDD_IVA)
VDD_MPU: U4.K17(VDD_MPU) U4.K18(VDD_MPU) U4.L15(VDD_MPU) U4.L16(VDD_MPU) U4.L17(VDD_MPU) U4.L18(VDD_MPU) U4.L19(VDD_MPU) U4.M15(VDD_MPU) U4.M16(VDD_MPU) U4.M17(VDD_MPU) U4.M18(VDD_MPU) U4.N17(VDD_MPU) U4.N18(VDD_MPU) U4.P17(VDD_MPU) U4.P18(VDD_MPU) U4.R18(VDD_MPU)
NetC106_1: C106.1 U4.Y13(CAP_VDDRAM_GPU)
NetC107_1: C107.1 U4.Y14(CAP_VBBLDO_GPU)
NetC108_1: C108.1 U4.Y15(CAP_VDDRAM_CORE3)
NetC109_1: C109.1 U4.Y16(CAP_VDDRAM_CORE5)
NetC179_1: C179.1 U4.T20(CAP_VDDRAM_IVA)
NetC204_1: C204.1 U4.R20(CAP_VBBLDO_IVA)
NetC214_1: C214.1 U4.P19(CAP_VDDRAM_CORE4)
NetC254_1: C254.1 U4.K19(CAP_VDDRAM_MPU2)
NetC260_1: C260.1 U4.J19(CAP_VDDRAM_CORE2)
NetC273_1: C273.1 U4.J16(CAP_VBBLDO_MPU)
NetC274_1: C274.1 U4.J9(CAP_VDDRAM_DSPEVE2)
NetC275_1: C275.1 U4.J10(CAP_VDDRAM_DSPEVE1)
NetC276_1: C276.1 U4.L9(CAP_VDDRAM_CORE1)
NetC277_1: C277.1 U4.K9(CAP_VBBLDO_DSPEVE)
NetC279_1: C279.1 U4.K16(CAP_VDDRAM_MPU1)
NetTP8_1: TP8.1(TP) U4.K14(RSVK14)

Not connected (* = marked no-connect by the designer): U4 A27(RSVA27)* B28(RSVB28)* Y5(RSVY5)* Y10(RSVY10)*

### Notes on the sheet
- (in symbol AM57X, part Y) AM57X Power /
- (in symbol Embest Title) Title:; Size:; Document Number:; Rev:; Draw By:; Date:; Sheet:; of

### Library data of the parts
C12 C26 = C: CAP,47UF,+/-20%,X5R,6.3V,SMD0805; Manufacturer Part Number: GRM21BR60J476ME15L; Manufacturer: MURATA; Embest PN: 1004001100164; Part Type: Ceramic Capacitor
C106 C108 C204 C260 C274 C276 C279 = C: as C283 on sheet 09 MMC_UBOOT; Part Type: Ceramic Capacitor
C107 C109 C179 C214 C254 C273 C275 C277 = C: CAP,1UF,+/-10%,X5R,10V,SMD0402; Manufacturer: Murata; Manufacturer Part Number: GRM155R61A105KE15D; Embest PN: 1004001100057; Part Type: Ceramic Capacitor
C118 C136 C146 C148 C174 = C: CAP,10NF,+/-10%,X7R,16V,SMD0402; Manufacturer Part Number: GRM155R71C103KA01D; Manufacturer: MURATA; Embest PN: 1004001100039; Part Type: Ceramic Capacitor
C119 C138 C140 C154 C165 C201 C210 C211 C224 C235 C237 C262 C299 = C: CAP,10NF,+/-10%,X7R,16V,SMD0402; Manufacturer: MURATA; Manufacturer Part Number: GRM155R71C103KA01D; Embest PN: 1004001100039; Part Type: Ceramic Capacitor
C120 C124 = C: CAP,10UF,+/-10%,X5R,10V,SMD0603; Manufacturer: Murata; Manufacturer Part Number: GRM188R61A106KE69D; Embest PN: 1004001100129; Part Type: Ceramic Capacitor; Datasheet: Y:\ÐÂK3ÏµÍ³ÎïÁÏdatasheet\[1003_1004]capacitor-resistor µçÈÝ¡¢µç×è\1004001100129T2 C1608X5R1A106M.pdf
C123 = C: as C281 on sheet 09 MMC_UBOOT; Datasheet: Y:\ÐÂK3ÏµÍ³ÎïÁÏdatasheet\[1003_1004]capacitor-resistor µçÈÝ¡¢µç×è\1004001100047-GRM155R71C104KA88D.pdf; Part Type: Ceramic Capacitor
C180 C198 = C: CAP,10UF,+/-10%,X5R,10V,SMD0603; Manufacturer Part Number: GRM188R61A106KE69D; Manufacturer: Murata; Embest PN: 1004001100129; Datasheet: Y:\ÐÂK3ÏµÍ³ÎïÁÏdatasheet\[1003_1004]capacitor-resistor µçÈÝ¡¢µç×è\1004001100129T2 C1608X5R1A106M.pdf; Part Type: Ceramic Capacitor
C492 C496 = C: as C285 on sheet 09 MMC_UBOOT; Part Type: Ceramic Capacitor; Datasheet: Y:\ÐÂK3ÏµÍ³ÎïÁÏdatasheet\[1003_1004]capacitor-resistor µçÈÝ¡¢µç×è\1004001100047-GRM155R71C104KA88D.pdf
TP8 = TEST POINT: Test point,DIA 30mil; PCB Footprint: TP30; Embest PN: PN008; Part Type: TP
U4 = AM57X: as U4 on sheet 09 MMC_UBOOT; Status: BeagleBone AI; Manufacturer Part Number: AM5729BABCXEAR; Manufacturer: TI; Part Type: MPU
*#10 = Embest Title: Page Create Date: May 29, 2006; WebSite: http://www.embest-tech.com; Company: Embest; Page Modify Date: *